# Altium project EPS.PrjPcb (part 2 of 4)

## Sheet EPS_MPPT_XY_Interface.SchDoc: MPPT-X and MPPT-Y / Interface
size A4; Date: 2015-10-14; ApprovedBy: (not approved); CheckedBy: (not checked); Author: Piotr Kuligowski; DocumentNumber: PWSat2-xxx-DW-xxx; Revision: 3; SheetNumber: 10; SheetTotal: 51; Model: FPM
Used 3 times, as channels Top/MPPT X/MPPTX Interface to uC, Top/MPPT Y+/MPPTY Interface to uC, Top/MPPT Y-/MPPTY Interface to uC. Parts and nets are listed once, with the designators drawn on the sheet.
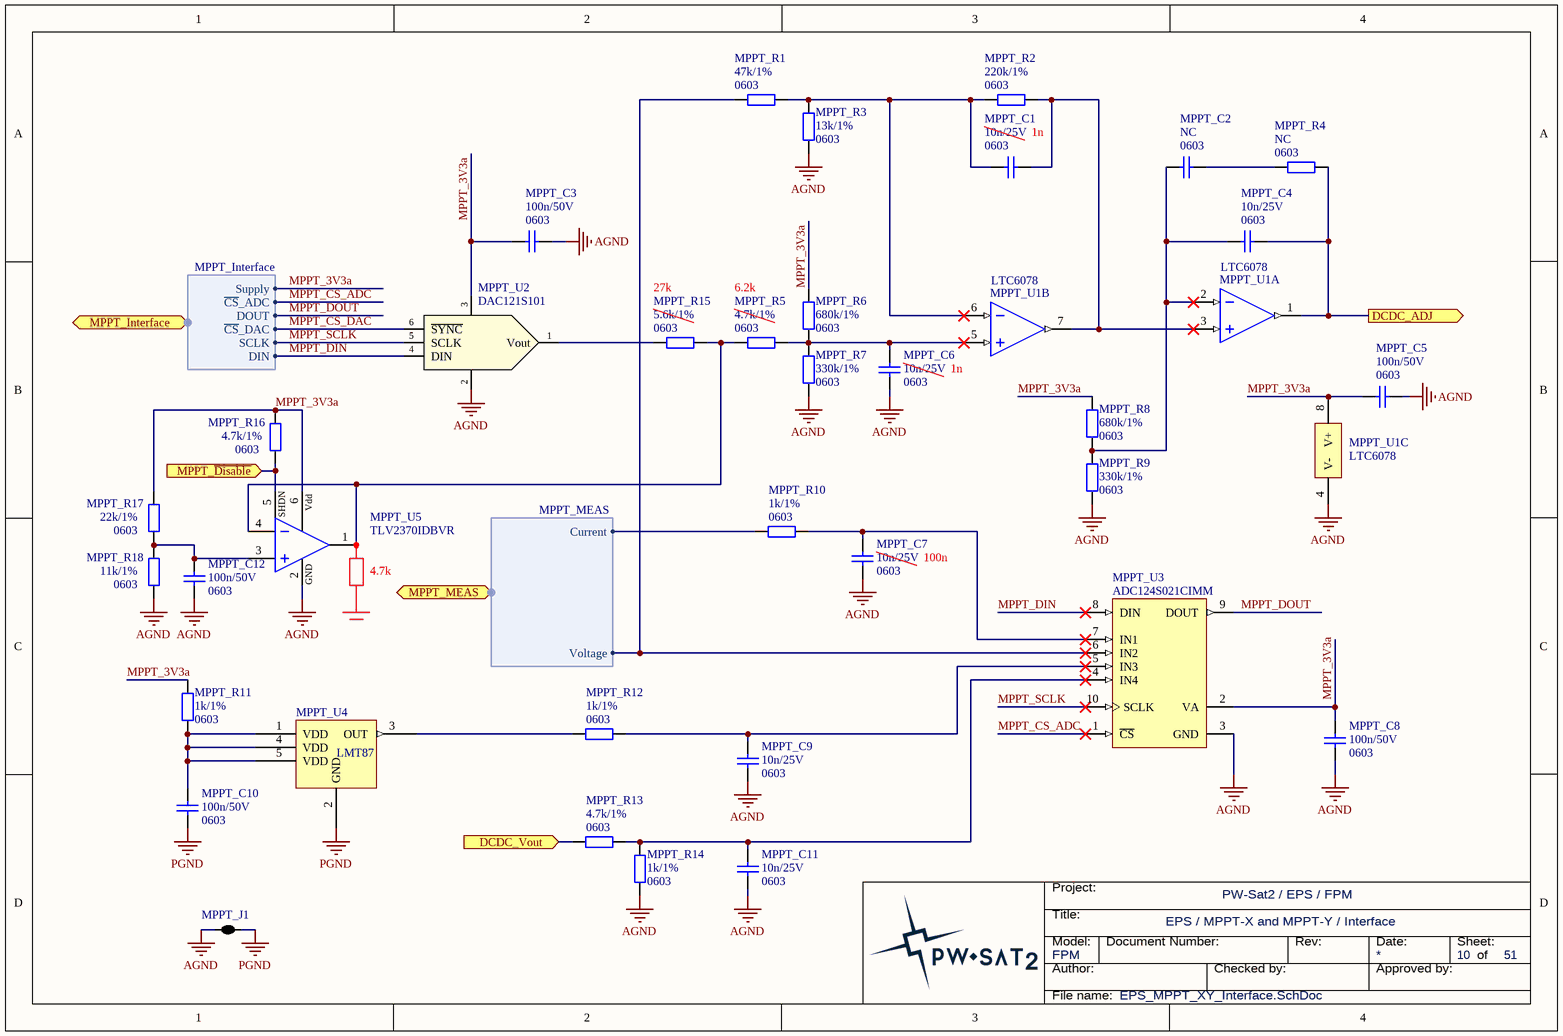
[diagram p8: EPS_MPPT_XY_Interface.SchDoc]

### Parts
MPPT_C1  value 10n/25V  Package: 0603  [SMD_Capacitor_0603]  (hidden comment: Cap)
MPPT_C2  value NC  Package: 0603  [SMD_Capacitor_0603]  (hidden comment: Cap)
MPPT_C3  Package: 0603  [SMD_Capacitor_0603]  (hidden comment: 100n/50V)
MPPT_C4  value 10n/25V  Package: 0603  [SMD_Capacitor_0603]  (hidden comment: Cap)
MPPT_C5  Package: 0603  [SMD_Capacitor_0603]  (hidden comment: 100n/50V)
MPPT_C6  value 10n/25V  Package: 0603  [SMD_Capacitor_0603]  (hidden comment: Cap)
MPPT_C7  value 10n/25V  Package: 0603  [SMD_Capacitor_0603]  (hidden comment: Cap)
MPPT_C8  Package: 0603  [SMD_Capacitor_0603]  (hidden comment: 100n/50V)
MPPT_C9  value 10n/25V  Package: 0603  [SMD_Capacitor_0603]  (hidden comment: Cap)
MPPT_C10  Package: 0603  [SMD_Capacitor_0603]  (hidden comment: 100n/50V)
MPPT_C11  value 10n/25V  Package: 0603  [SMD_Capacitor_0603]  (hidden comment: Cap)
MPPT_C12  value 100n/50V  Package: 0603  [SMD_Capacitor_0603]  (hidden comment: Cap)
MPPT_J1  2 way net tie junction  [2way_LP]  (value not drawn)  (net tie, no BOM)
MPPT_R1  Package: 0603  [SMD_Resistor_0603]  (hidden comment: 47k/1%)
MPPT_R2  Package: 0603  [SMD_Resistor_0603]  (hidden comment: 220k/1%)
MPPT_R3  Package: 0603  [SMD_Resistor_0603]  (hidden comment: 13k/1%)
MPPT_R4  Package: 0603  [SMD_Resistor_0603]  (hidden comment: NC)
MPPT_R5  Package: 0603  [SMD_Resistor_0603]  (hidden comment: 4.7k/1%)
MPPT_R6  Package: 0603  [SMD_Resistor_0603]  (hidden comment: 680k/1%)
MPPT_R7  Package: 0603  [SMD_Resistor_0603]  (hidden comment: 330k/1%)
MPPT_R8  Package: 0603  [SMD_Resistor_0603]  (hidden comment: 680k/1%)
MPPT_R9  Package: 0603  [SMD_Resistor_0603]  (hidden comment: 330k/1%)
MPPT_R10  Package: 0603  [SMD_Resistor_0603]  (hidden comment: 1k/1%)
MPPT_R11  Package: 0603  [SMD_Resistor_0603]  (hidden comment: 1k/1%)
MPPT_R12  Package: 0603  [SMD_Resistor_0603]  (hidden comment: 1k/1%)
MPPT_R13  Package: 0603  [SMD_Resistor_0603]  (hidden comment: 4.7k/1%)
MPPT_R14  Package: 0603  [SMD_Resistor_0603]  (hidden comment: 1k/1%)
MPPT_R15  Package: 0603  [SMD_Resistor_0603]  (hidden comment: 5.6k/1%)
MPPT_R16  Package: 0603  [SMD_Resistor_0603]  (hidden comment: 4.7k/1%)
MPPT_R17  Package: 0603  [SMD_Resistor_0603]  (hidden comment: 22k/1%)
MPPT_R18  Package: 0603  [SMD_Resistor_0603]  (hidden comment: 11k/1%)
MPPT_U1  LTC6078  [MSOP-8]  (parts A,B,C of 3)
MPPT_U2  DAC121S101  [SOT23-6]
MPPT_U3  ADC124S021CIMM  [MUB10A_L]
MPPT_U4  LMT87  [SC70-LT5_N]
MPPT_U5  (no value)  [SOT23-6]

### Ports
DCDC_ADJ (out), DCDC_Vout (in), MPPT_Interface (harness MPPT_Interface), MPPT_MEAS (harness MPPT_MEAS), MPPT_~{Disable} (in)

### Harnesses
MPPT_Interface: DIN, DOUT, SCLK, ~{CS}_DAC, ~{CS}_ADC, Supply
MPPT_MEAS: Voltage, Current

### Nets
AGND: MPPT_C3.1 MPPT_C5.2 MPPT_C6.1 MPPT_C7.1 MPPT_C8.2 MPPT_C9.1 MPPT_C11.1 MPPT_C12.1 MPPT_J1.2 MPPT_R3.1 MPPT_R7.1 MPPT_R9.1 MPPT_R14.1 MPPT_R18.2 MPPT_U1.4(V-) MPPT_U2.2(GND) MPPT_U3.3(GND) MPPT_U5.2(GND)
PGND: MPPT_C10.2 MPPT_J1.1 MPPT_U4.2(GND)
DCDC_ADJ: MPPT_C4.2 MPPT_R4.1 MPPT_U1.1(OUT_A) ; port DCDC_ADJ
DCDC_Vout: MPPT_R13.2 ; port DCDC_Vout
MPPT_3V3a: MPPT_C3.2 MPPT_C5.1 MPPT_C8.1 MPPT_R6.2 MPPT_R8.2 MPPT_R11.1 MPPT_R16.1 MPPT_R17.1 MPPT_U1.8(V+) MPPT_U2.3(Va) MPPT_U3.2(VA) MPPT_U5.6(Vdd) ; port MPPT_Interface.Supply
MPPT_CS_ADC: MPPT_U3.1(~{CS}) ; port MPPT_Interface.~{CS}_ADC
MPPT_CS_DAC: MPPT_U2.6(~{SYNC}) ; port MPPT_Interface.~{CS}_DAC
MPPT_~{Disable}: MPPT_R16.2 MPPT_U5.5(SHDN) ; port MPPT_~{Disable}
MPPT_DIN: MPPT_U2.4(DIN) MPPT_U3.8(DIN) ; port MPPT_Interface.DIN
MPPT_DOUT: MPPT_U3.9(DOUT) ; port MPPT_Interface.DOUT
MPPT_SCLK: MPPT_U2.5(SCLK) MPPT_U3.10(SCLK) ; port MPPT_Interface.SCLK
NetMPPT_C1_1: MPPT_C1.1 MPPT_R1.1 MPPT_R2.2 MPPT_R3.2 MPPT_U1.6(IN-_B)
NetMPPT_C1_2: MPPT_C1.2 MPPT_R2.1 MPPT_U1.3(IN+_A) MPPT_U1.7(OUT_B)
NetMPPT_C2_1: MPPT_C2.1 MPPT_C4.1 MPPT_R8.1 MPPT_R9.2 MPPT_U1.2(IN-_A)
NetMPPT_C2_2: MPPT_C2.2 MPPT_R4.2
NetMPPT_C6_2: MPPT_C6.2 MPPT_R5.1 MPPT_R6.1 MPPT_R7.2 MPPT_U1.5(IN+_B)
NetMPPT_C7_2: MPPT_C7.2 MPPT_R10.1 MPPT_U3.7(IN1)
NetMPPT_C9_2: MPPT_C9.2 MPPT_R12.1 MPPT_U3.5(IN3)
NetMPPT_C10_1: MPPT_C10.1 MPPT_R11.2 MPPT_U4.1(VDD) MPPT_U4.4(VDD) MPPT_U4.5(VDD)
NetMPPT_C11_2: MPPT_C11.2 MPPT_R13.1 MPPT_R14.2 MPPT_U3.4(IN4)
NetMPPT_C12_2: MPPT_C12.2 MPPT_R17.2 MPPT_R18.1 MPPT_U5.3(IN+)
NetMPPT_R1_2: MPPT_R1.2 MPPT_U3.6(IN2) ; port MPPT_MEAS.Voltage
NetMPPT_R5_2: MPPT_R5.2 MPPT_R15.1 MPPT_U5.1(OUT) MPPT_U5.4(IN-)
NetMPPT_R10_2: MPPT_R10.2 ; port MPPT_MEAS.Current
NetMPPT_R12_2: MPPT_R12.2 MPPT_U4.3(OUT)
NetMPPT_R15_2: MPPT_R15.2 MPPT_U2.1(Vout)

### Channels
Top/MPPT X/MPPTX Interface to uC: designators end in _1; ports DCDC_ADJ=NetDCDCX_R7_2 DCDC_Vout=NetMPPT_R13_1_2 MPPT_~{Disable}=NetCTRLB_U1_1
Top/MPPT Y+/MPPTY Interface to uC: designators end in _2; ports DCDC_ADJ=NetDCDCY_R7_1_1 DCDC_Vout=NetEMIYO_C1_1_1 MPPT_~{Disable}=NetCTRLB_U1_2
Top/MPPT Y-/MPPTY Interface to uC: designators end in _3; ports DCDC_ADJ=NetDCDCY_R7_2_1 DCDC_Vout=NetEMIYO_C1_2_1 MPPT_~{Disable}=NetCTRLB_U1_3

### Notes on the sheet
- 1n
- (near MPPT_R15) 27k
- 6.2k
- (near MPPT_U1) 1n
- (near MPPT_U5) 4.7k
- 100n
- Title:
- Project:
- Author:
- Model:
- Document Number:
- Checked by:
- Rev:
- Date:
- Approved by:
- Sheet:
- of
- File name:

### Library data of the parts
MPPT_C3 MPPT_C5 MPPT_C8 MPPT_C10 = Cer_C0603T104K5RALTU: Ceramic Cap Kemet COTS 100n/50V X7R 0603; Manufacturer: Kemet; ManufacturerPartNumber: C0603T104K5RALTU; Value: 100n/50V
MPPT_J1 = 2way: ComponentLink1URL: http://www.edatools.cz/addons; ComponentLink1Description: Source; FootprintNote: LP=12mil, MP=40mil, HP=120mil
MPPT_R1-MPPT_R15 = Res
  MPPT_R1: Value: 47k/1%
  MPPT_R2: Value: 220k/1%
  MPPT_R3: Value: 13k/1%
  MPPT_R4: Value: NC
  MPPT_R5 MPPT_R13: Value: 4.7k/1%
  MPPT_R6 MPPT_R8: Value: 680k/1%
  MPPT_R7 MPPT_R9: Value: 330k/1%
  MPPT_R10-MPPT_R12 MPPT_R14: Value: 1k/1%
  MPPT_R15: Value: 5.6k/1%
MPPT_R16-MPPT_R18 = CRCW06034K70FKxxxx: 4.7k/1% Vishay CRCW 0603 Resistor. 100mW, 100ppm, 75V.; Manufacturer: Vishay; ManufactuerPartNumber: CRCW06034K70FKxxxx
  MPPT_R16: Value: 4.7k/1%
  MPPT_R17: Value: 22k/1%
  MPPT_R18: Value: 11k/1%
MPPT_U1 = LTC6078: Rail-to-rail, quad operational amplifier. Library compatible with LTC608X LTC607X op-amps; Manufacturer: Linear Technology; Value: LTC6078
MPPT_U2 = DAC121S101: 12-Bit Micro Power, RRO Digital-to-Analog Converter.; Manufacturer: Texas Instruments; Value: DAC121S101
MPPT_U3 = ADC124S021CIMM/NOPB: Manufacturer: Texas Instruments; ManufacturerPartNumber: ADC124S021CIMM/NOPB; Value: ADC124S021CIMM
MPPT_U4 = LMT87: Analog Temperature Sensors with Class-AB Output
MPPT_U5 = TLV2370IDBVR: 3-MHz Rail-to-Rail In/Out Single Operational Amplifier; Manufacturer: Texas Instruments; HelpUrl: http://www.ti.com/lit/ds/symlink/tlv2370.pdf; ManufacturerPartNumber: TLV2370IDBVR

## Sheet EPS_MPPT_XY_Measurements.SchDoc: MPPT-X and MPPT-Y / Measurements
size A4; ApprovedBy: (not approved); CheckedBy: (not checked); Author: Piotr Kuligowski; DocumentNumber: PWSat2-xxx-DW-xxx; Revision: 3; SheetNumber: 7; SheetTotal: 51; Model: FPM
Used 3 times, as channels Top/MPPT X/MPPTX Measurements, Top/MPPT Y+/MPPTY Measurements, Top/MPPT Y-/MPPTY Measurements. Parts and nets are listed once, with the designators drawn on the sheet.
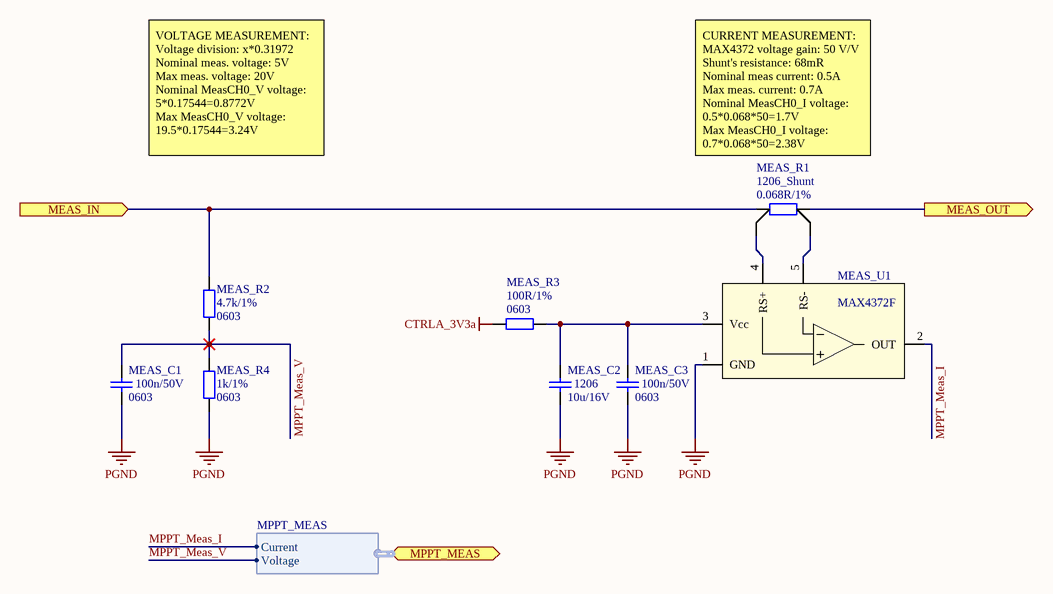
[diagram p9: EPS_MPPT_XY_Measurements.SchDoc]

### Parts
MEAS_C1  Package: 0603  [SMD_Capacitor_0603]  (hidden comment: 100n/50V)
MEAS_C2  Packge: 1206  [SMD_Capacitor_1206]  (hidden comment: 10u/16V)
MEAS_C3  Package: 0603  [SMD_Capacitor_0603]  (hidden comment: 100n/50V)
MEAS_R1  Package: 1206_Shunt  [SMD_Resistor-Shunt_1206]  (hidden comment: 0.068R/1%)
MEAS_R2  Package: 0603  [SMD_Resistor_0603]  (hidden comment: 4.7k/1%)
MEAS_R3  Package: 0603  [SMD_Resistor_0603]  (hidden comment: 100R/1%)
MEAS_R4  Package: 0603  [SMD_Resistor_0603]  (hidden comment: 1k/1%)
MEAS_U1  MAX4372F  [SOT23-5]

### Ports
MEAS_IN (in), MEAS_OUT (out), MPPT_MEAS (harness MPPT_MEAS)

### Harnesses
MPPT_MEAS: Voltage, Current

### Nets
CTRLA_3V3a: MEAS_R3.1
PGND: MEAS_C1.2 MEAS_C2.2 MEAS_C3.2 MEAS_R4.2 MEAS_U1.1(GND)
MEAS_IN: MEAS_R1.1 MEAS_R2.1 ; port MEAS_IN
MEAS_OUT: MEAS_R1.4 ; port MEAS_OUT
MPPT_Meas_I: MEAS_U1.2(OUT) ; port MPPT_MEAS.Current
MPPT_Meas_V: MEAS_C1.1 MEAS_R2.2 MEAS_R4.1 ; port MPPT_MEAS.Voltage
NetMEAS_C2_1: MEAS_C2.1 MEAS_C3.1 MEAS_R3.2 MEAS_U1.3(Vcc)
NetMEAS_R1_2: MEAS_R1.2 MEAS_U1.4(RS+)
NetMEAS_R1_3: MEAS_R1.3 MEAS_U1.5(RS-)

### Channels
Top/MPPT X/MPPTX Measurements: designators end in _1; ports MEAS_IN=NetMEAS_R1_1_1 MEAS_OUT=NetEMIXI_C1_1
Top/MPPT Y+/MPPTY Measurements: designators end in _2; ports MEAS_IN=NetMEAS_R1_2_1 MEAS_OUT=NetEMIYI_C1_1_1
Top/MPPT Y-/MPPTY Measurements: designators end in _3; ports MEAS_IN=NetMEAS_R1_3_1 MEAS_OUT=NetEMIYI_C1_2_1

### Notes on the sheet
- VOLTAGE MEASUREMENT:
  Voltage division: x*0.31972
  Nominal meas. voltage: 5V
  Max meas. voltage: 20V
  Nominal MeasCH0_V voltage: 5*0.17544=0.8772V
  Max MeasCH0_V voltage: 19.5*0.17544=3.24V
- CURRENT MEASUREMENT:
  MAX4372 voltage gain: 50 V/V
  Shunt's resistance: 68mR
  Nominal meas current: 0.5A
  Max meas. current: 0.7A
  Nominal MeasCH0_I voltage: 0.5*0.068*50=1.7V
  Max MeasCH0_I voltage: 0.7*0.068*50=2.38V
- Title:
- Project:
- Author:
- Model:
- Document Number:
- Checked by:
- Rev:
- Date:
- Approved by:
- Sheet:
- of
- File name:

### Library data of the parts
MEAS_C1 MEAS_C3 = Cer_C0603T104K5RALTU: Ceramic Cap Kemet COTS 100n/50V X7R 0603; Manufacturer: Kemet; ManufacturerPartNumber: C0603T104K5RALTU; Value: 100n/50V
MEAS_C2 = Cer_C1206T106K4RACTU: Ceramic Cap Kemet COTS 10u/16V X7R 1206; ManufacturerPartNumber: C1206T106K4RACTU; Manufacturer: Kemet; Value: 10u/16V
MEAS_R1 = ERJ-8BWFR068V: Panasonic Resistor 68mR 1% 1206 1W; Manufacturer: Panasonic; ManufacturerPartNumber: ERJ-8BWFR068V; Value: 0.068R/1%
MEAS_R2-MEAS_R4 = Res
  MEAS_R2: Value: 4.7k/1%
  MEAS_R3: Value: 100R/1%
  MEAS_R4: Value: 1k/1%
MEAS_U1 = MAX4372: High-Side Current-Sense Amplifier with Voltage Output; Manufacturer: Maxim Integrated Products; Value: MAX4372F

## Sheet EPS_MPPT_X_EMI-Filter_In.SchDoc: MPPT-X / EMI-Filter / In
size A4; ApprovedBy: (not approved); CheckedBy: (not checked); Author: Piotr Kuligowski; DocumentNumber: PWSat2-xxx-DW-xxx; Revision: 3; SheetNumber: 8; SheetTotal: 51; Model: FPM
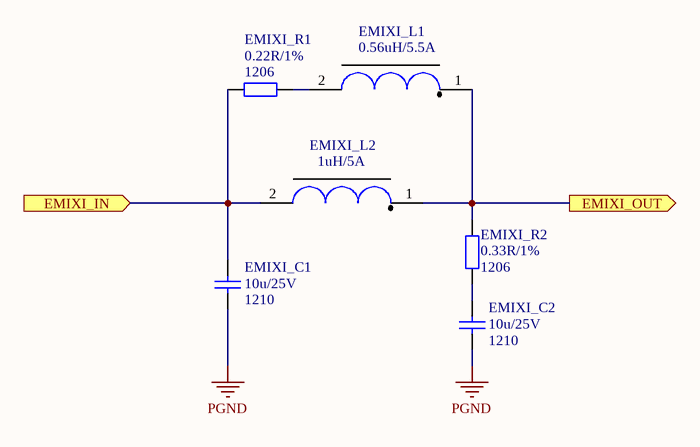
[diagram p10: EPS_MPPT_X_EMI-Filter_In.SchDoc]

### Parts
EMIXI_C1  Package: 1210  [SMD_Capacitor_1210]  (hidden comment: 10u/25V)
EMIXI_C2  Package: 1210  [SMD_Capacitor_1210]  (hidden comment: 10u/25V)
EMIXI_L1  0.56uH/5.5A  [Vishay_IHLP1212]
EMIXI_L2  1uH/5A  [Vishay_IHLP1212]
EMIXI_R1  Package: 1206  [SMD_Resistor_1206]  (hidden comment: 0.22R/1%)
EMIXI_R2  Package: 1206  [SMD_Resistor_1206]  (hidden comment: 0.33R/1%)

### Ports
EMIXI_IN (in), EMIXI_OUT (out)

### Nets
PGND: EMIXI_C1.2 EMIXI_C2.2
NetDCDCX_C1_2: EMIXI_L1.1 EMIXI_L2.1 EMIXI_R2.2 ; port EMIXI_OUT
NetEMIXI_C1_1: EMIXI_C1.1 EMIXI_L2.2 EMIXI_R1.1 ; port EMIXI_IN
NetEMIXI_C2_1: EMIXI_C2.1 EMIXI_R2.1
NetEMIXI_L1_2: EMIXI_L1.2 EMIXI_R1.2

### Notes on the sheet
- Title:
- Project:
- Author:
- Model:
- Document Number:
- Checked by:
- Rev:
- Date:
- Approved by:
- Sheet:
- of
- File name:

### Library data of the parts
EMIXI_C1 EMIXI_C2 = Cer_GCJ32ER71E106KA12L: Ceramic Cap Murata Automotive 10u/25V X7R 1210; Manufacturer: Murata; ManufacturerPartNumber: GCJ32ER71E106KA12L; Value: 10u/25V
EMIXI_L1 = IHLP1212BZERR56M11: Vishay IHLP1212 Inductor, L=0.56uH, Irise40deg=5.5A, ESR=16mR, SRF=1MHz.; Manufacturer: Vishay; ManufacturerPartNumber: IHLP1212BZERR56M11; Value: 0.56uH/5.5A
EMIXI_L2 = IHLP1212BZER1R0M11: Vishay IHLP1212 Inductor, L=1uH, Irise40deg=5A, ESR=20mR, SRF=1MHz.; Manufacturer: Vishay; ManufacturerPartNumber: IHLP1212BZER1R0M11; Value: 1uH/5A
EMIXI_R1 = ERJ-8BQFR22V: Panasonic Resistor 0.22R 1% 1206 330mW; Manufacturer: Panasonic; ManufacturerPartNumber: ERJ-8BQFR22V; Value: 0.22R/1%
EMIXI_R2 = ERJ-8BQFR33V: Panasonic Resistor 0.33R 1% 1206 330mW; Manufacturer: Panasonic; ManufacturerPartNumber: ERJ-8BQFR33V; Value: 0.33R/1%

## Sheet EPS_MPPT_X_OR_MPB.SchDoc: MPPT-X / MPB ORing
size A4; ApprovedBy: (not approved); CheckedBy: (not checked); Author: Piotr Kuligowski; DocumentNumber: PWSat2-xxx-DW-xxx; Revision: 3; SheetNumber: 12; SheetTotal: 51; Model: FPM
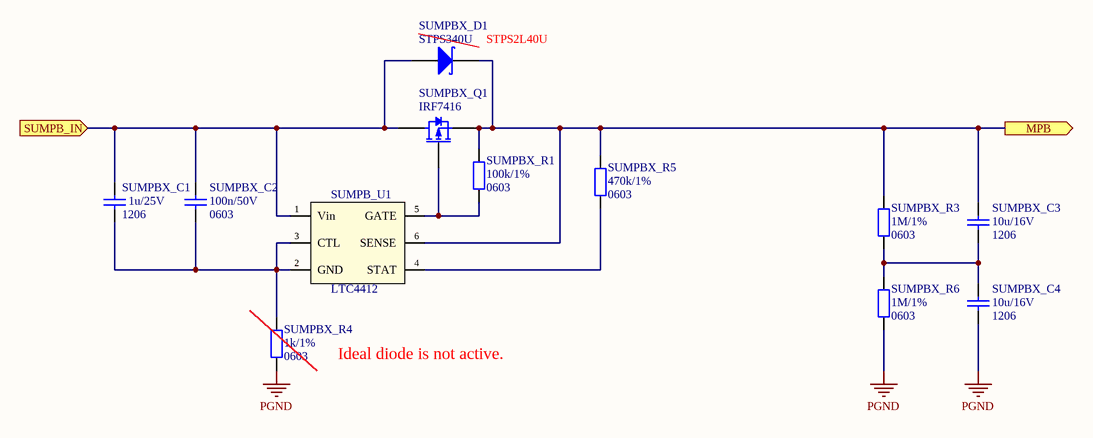
[diagram p11: EPS_MPPT_X_OR_MPB.SchDoc]

### Parts
SUMPB_U1  LTC4412  [SOT23-6]
SUMPBX_C1  Package: 1206  [SMD_Capacitor_1206]  (hidden comment: 1u/25V)
SUMPBX_C2  Package: 0603  [SMD_Capacitor_0603]  (hidden comment: 100n/50V)
SUMPBX_C3  Packge: 1206  [SMD_Capacitor_1206]  (hidden comment: 10u/16V)
SUMPBX_C4  Packge: 1206  [SMD_Capacitor_1206]  (hidden comment: 10u/16V)
SUMPBX_D1  STPS340U  [DO-214AA]
SUMPBX_Q1  IRF7416  [SOIC-8-N_SSSGDDDD]
SUMPBX_R1  Package: 0603  [SMD_Resistor_0603]  (hidden comment: 100k/1%)
SUMPBX_R3  Package: 0603  [SMD_Resistor_0603]  (hidden comment: 1M/1%)
SUMPBX_R4  Package: 0603  [SMD_Resistor_0603]  (hidden comment: 1k/1%)
SUMPBX_R5  Package: 0603  [SMD_Resistor_0603]  (hidden comment: 470k/1%)
SUMPBX_R6  Package: 0603  [SMD_Resistor_0603]  (hidden comment: 1M/1%)

### Ports
MPB (out), SUMPB_IN (in)

### Nets
PGND: SUMPBX_C4.2 SUMPBX_R4.2 SUMPBX_R6.2
PC-104_Kill-Switch_Pri: SUMPB_U1.6(SENSE) SUMPBX_C3.1 SUMPBX_D1.K SUMPBX_Q1.S SUMPBX_R1.1 SUMPBX_R3.1 SUMPBX_R5.1 ; port MPB
NetMPPT_R13_1_2: SUMPB_U1.1(Vin) SUMPBX_C1.1 SUMPBX_C2.1 SUMPBX_D1.A SUMPBX_Q1.D ; port SUMPB_IN
NetSUMPB_U1_2: SUMPB_U1.2(GND) SUMPB_U1.3(CTL) SUMPBX_C1.2 SUMPBX_C2.2 SUMPBX_R4.1
NetSUMPB_U1_4: SUMPB_U1.4(STAT) SUMPBX_R5.2
NetSUMPB_U1_5: SUMPB_U1.5(GATE) SUMPBX_Q1.G SUMPBX_R1.2
NetSUMPBX_C3_2: SUMPBX_C3.2 SUMPBX_C4.1 SUMPBX_R3.2 SUMPBX_R6.1

### Notes on the sheet
- (near SUMPBX_D1) STPS2L40U
- Ideal diode is not active.
- Title:
- Project:
- Author:
- Model:
- Document Number:
- Checked by:
- Rev:
- Date:
- Approved by:
- Sheet:
- of
- File name:

### Library data of the parts
SUMPB_U1 = LTC4412: Ideal Diode, Low Loss PowerPath Controller.; Manufacturer: Linear Technology; Value: LTC4412
SUMPBX_C1 = Cer_C1206T105K3RALTU: Ceramic Cap Kemet COTS 1u/25V X7R 1206; ManufacturerPartNumber: C1206T105K3RALTU; Manufacturer: Kemet; Value: 1u/25V
SUMPBX_C2 = Cer_GCJ188R71H104KA12D: Ceramic Cap Murata Automotive 100n/50V X7R 0603; Manufacturer: Murata; ManufacturerPartNumber: GCJ188R71H104KA12D; Value: 100n/50V
SUMPBX_C3 SUMPBX_C4 = Cer_C1206T106K4RACTU: Ceramic Cap Kemet COTS 10u/16V X7R 1206; ManufacturerPartNumber: C1206T106K4RACTU; Manufacturer: Kemet; Value: 10u/16V
SUMPBX_D1 = STPS340x: 3A/40V Power Schottky Rectifier.; Manufacturer: STMicroelectronics; Value: STPS340U
SUMPBX_Q1 = IRF7416: 10A/30V HEXFET Power P-MOSFET.; Manufacturer: International Rectifier; Value: IRF7416
SUMPBX_R1 SUMPBX_R3-SUMPBX_R6 = Res
  SUMPBX_R1: Value: 100k/1%
  SUMPBX_R3 SUMPBX_R6: Value: 1M/1%
  SUMPBX_R4: Value: 1k/1%
  SUMPBX_R5: Value: 470k/1%

## Sheet EPS_MPPT_Y.SchDoc: MPPT-Y
size A3; ApprovedBy: (not approved); CheckedBy: (not checked); Author: Piotr Kuligowski; DocumentNumber: PWSat2-xxx-DW-xxx; Revision: 3; SheetNumber: 17; SheetTotal: 51; Model: FPM
Used 2 times, as channels Top/MPPT Y+, Top/MPPT Y-. Parts and nets are listed once, with the designators drawn on the sheet.
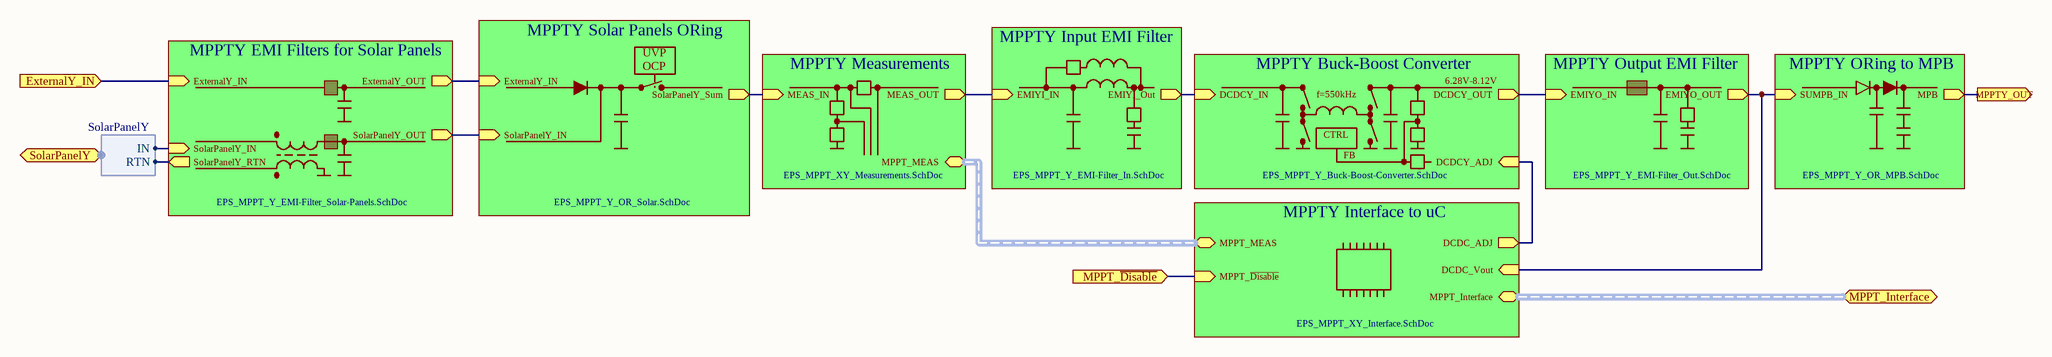
[diagram p12: EPS_MPPT_Y.SchDoc]

### Sub-sheets
MPPTY Buck-Boost Converter = EPS_MPPT_Y_Buck-Boost-Converter.SchDoc: DCDCY_IN (in), DCDCY_OUT (out), DCDCY_ADJ (in)
MPPTY EMI Filters for Solar Panels = EPS_MPPT_Y_EMI-Filter_Solar-Panels.SchDoc: SolarPanelY_IN (in), ExternalY_IN (in), SolarPanelY_RTN (out), ExternalY_OUT (out), SolarPanelY_OUT (out)
MPPTY Input EMI Filter = EPS_MPPT_Y_EMI-Filter_In.SchDoc: EMIYI_Out (out), EMIYI_IN (in)
MPPTY Interface to uC = EPS_MPPT_XY_Interface.SchDoc: DCDC_ADJ (out), MPPT_Interface (harness MPPT_Interface), MPPT_MEAS (harness MPPT_MEAS), DCDC_Vout (in), MPPT_~{Disable} (in)
MPPTY Measurements = EPS_MPPT_XY_Measurements.SchDoc: MEAS_IN (in), MEAS_OUT (out), MPPT_MEAS (harness MPPT_MEAS)
MPPTY ORing to MPB = EPS_MPPT_Y_OR_MPB.SchDoc: SUMPB_IN (in), MPB (out)
MPPTY Output EMI Filter = EPS_MPPT_Y_EMI-Filter_Out.SchDoc: EMIYO_IN (in), EMIYO_OUT (out)
MPPTY Solar Panels ORing = EPS_MPPT_Y_OR_Solar.SchDoc (file not in this document): ExternalY_IN (in), SolarPanelY_IN (in), SolarPanelY_Sum (out)

### Ports
ExternalY_IN (in), MPPT_Interface (harness MPPT_Interface), MPPT_~{Disable} (in), MPPTY_OUT (out), SolarPanelY (harness SolarPanelY)

### Harnesses
SolarPanelY: IN, RTN

### Nets
ExternalY_IN: port ExternalY_IN, sheet MPPTY EMI Filters for Solar Panels/ExternalY_IN
MPPT_~{Disable}: port MPPT_~{Disable}, sheet MPPTY Interface to uC/MPPT_~{Disable}
MPPTY_OUT: port MPPTY_OUT, sheet MPPTY ORing to MPB/MPB
(unnamed): sheet MPPTY Buck-Boost Converter/DCDCY_IN, sheet MPPTY Input EMI Filter/EMIYI_Out
(unnamed): sheet MPPTY Buck-Boost Converter/DCDCY_OUT, sheet MPPTY Output EMI Filter/EMIYO_IN
(unnamed): sheet MPPTY Buck-Boost Converter/DCDCY_ADJ, sheet MPPTY Interface to uC/DCDC_ADJ
(unnamed): sheet MPPTY Solar Panels ORing/ExternalY_IN, sheet MPPTY EMI Filters for Solar Panels/ExternalY_OUT
(unnamed): sheet MPPTY Solar Panels ORing/SolarPanelY_IN, sheet MPPTY EMI Filters for Solar Panels/SolarPanelY_OUT
(unnamed): sheet MPPTY Solar Panels ORing/SolarPanelY_Sum, sheet MPPTY Measurements/MEAS_IN
(unnamed): sheet MPPTY EMI Filters for Solar Panels/SolarPanelY_IN, port SolarPanelY.IN
(unnamed): sheet MPPTY EMI Filters for Solar Panels/SolarPanelY_RTN, port SolarPanelY.RTN
(unnamed): sheet MPPTY Interface to uC/DCDC_Vout, sheet MPPTY Output EMI Filter/EMIYO_OUT, sheet MPPTY ORing to MPB/SUMPB_IN
(unnamed): sheet MPPTY Measurements/MEAS_OUT, sheet MPPTY Input EMI Filter/EMIYI_IN

### Channels
Top/MPPT Y+: ports ExternalY_IN=PC-104_EXTY+ MPPT_~{Disable}=NetCTRLB_U1_2 MPPTY_OUT=PC-104_Kill-Switch_Pri
Top/MPPT Y-: ports ExternalY_IN=PC-104_EXTY- MPPT_~{Disable}=NetCTRLB_U1_3 MPPTY_OUT=PC-104_Kill-Switch_Pri

### Buses and harness runs
harness port MPPT_Interface = sheet MPPTY Interface to uC/MPPT_Interface
harness sheet MPPTY Interface to uC/MPPT_MEAS = sheet MPPTY Measurements/MPPT_MEAS

### Notes on the sheet
- UVP
- OCP
- f=550kHz
- CTRL
- 6.28V-8.12V
- FB
- Title:
- Project:
- Author:
- Model:
- Document Number:
- Checked by:
- Rev:
- Date:
- Approved by:
- Sheet:
- of
- File name:

## Sheet EPS_MPPT_Y_Buck-Boost-Converter.SchDoc: Controlled Buck-Boost Converter CH1
size A4; Date: 2016-01-06; Author: Piotr Kuligowski; DocumentNumber: PWSat2-xxx-DW-xxx; Revision: 1-0; SheetNumber: 21; SheetTotal: 51; Model: EM1
Used 2 times, as channels Top/MPPT Y+/MPPTY Buck-Boost Converter, Top/MPPT Y-/MPPTY Buck-Boost Converter. Parts and nets are listed once, with the designators drawn on the sheet.
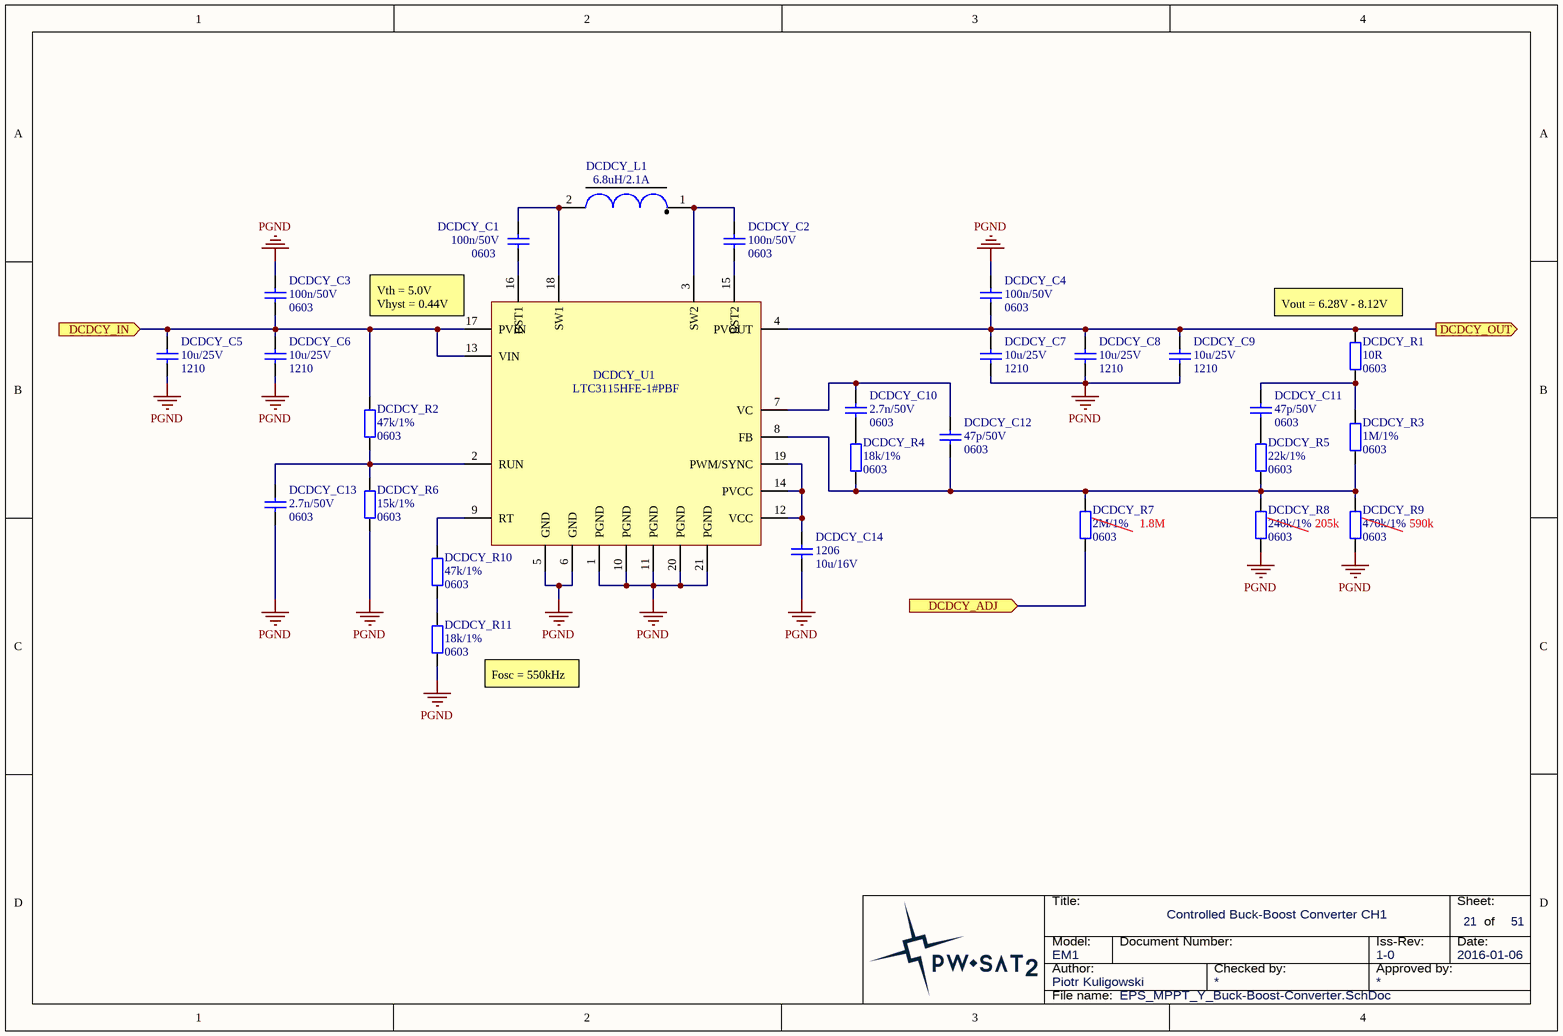
[diagram p13: EPS_MPPT_Y_Buck-Boost-Converter.SchDoc]

### Parts
DCDCY_C1  Package: 0603  [SMD_Capacitor_0603]  (hidden comment: 100n/50V)
DCDCY_C2  Package: 0603  [SMD_Capacitor_0603]  (hidden comment: 100n/50V)
DCDCY_C3  Package: 0603  [SMD_Capacitor_0603]  (hidden comment: 100n/50V)
DCDCY_C4  Package: 0603  [SMD_Capacitor_0603]  (hidden comment: 100n/50V)
DCDCY_C5  Package: 1210  [SMD_Capacitor_1210]  (hidden comment: 10u/25V)
DCDCY_C6  Package: 1210  [SMD_Capacitor_1210]  (hidden comment: 10u/25V)
DCDCY_C7  Package: 1210  [SMD_Capacitor_1210]  (hidden comment: 10u/25V)
DCDCY_C8  Package: 1210  [SMD_Capacitor_1210]  (hidden comment: 10u/25V)
DCDCY_C9  Package: 1210  [SMD_Capacitor_1210]  (hidden comment: 10u/25V)
DCDCY_C10  value 2.7n/50V  Package: 0603  [SMD_Capacitor_0603]  (hidden comment: Cap)
DCDCY_C11  value 47p/50V  Package: 0603  [SMD_Capacitor_0603]  (hidden comment: Cap)
DCDCY_C12  value 47p/50V  Package: 0603  [SMD_Capacitor_0603]  (hidden comment: Cap)
DCDCY_C13  value 2.7n/50V  Package: 0603  [SMD_Capacitor_0603]  (hidden comment: Cap)
DCDCY_C14  Packge: 1206  [SMD_Capacitor_1206]  (hidden comment: 10u/16V)
DCDCY_L1  6.8uH/2.1A  [Coilcraft_MSS6132]
DCDCY_R1  Package: 0603  [SMD_Resistor_0603]  (hidden comment: 10R)
DCDCY_R2  Package: 0603  [SMD_Resistor_0603]  (hidden comment: 47k/1%)
DCDCY_R3  Package: 0603  [SMD_Resistor_0603]  (hidden comment: 1M/1%)
DCDCY_R4  Package: 0603  [SMD_Resistor_0603]  (hidden comment: 18k/1%)
DCDCY_R5  Package: 0603  [SMD_Resistor_0603]  (hidden comment: 22k/1%)
DCDCY_R6  Package: 0603  [SMD_Resistor_0603]  (hidden comment: 15k/1%)
DCDCY_R7  Package: 0603  [SMD_Resistor_0603]  (hidden comment: 2M/1%)
DCDCY_R8  Package: 0603  [SMD_Resistor_0603]  (hidden comment: 240k/1%)
DCDCY_R9  Package: 0603  [SMD_Resistor_0603]  (hidden comment: 470k/1%)
DCDCY_R10  Package: 0603  [SMD_Resistor_0603]  (hidden comment: 47k/1%)
DCDCY_R11  Package: 0603  [SMD_Resistor_0603]  (hidden comment: 18k/1%)
DCDCY_U1  LTC3115HFE-1#PBF  [LT-FE-20-EPV-CA_N]

### Ports
DCDCY_ADJ (in), DCDCY_IN (in), DCDCY_OUT (out)

### Nets
PGND: DCDCY_C3.1 DCDCY_C4.1 DCDCY_C5.2 DCDCY_C6.2 DCDCY_C7.2 DCDCY_C8.2 DCDCY_C9.2 DCDCY_C13.2 DCDCY_C14.2 DCDCY_R6.2 DCDCY_R8.2 DCDCY_R9.2 DCDCY_R11.2 DCDCY_U1.1(PGND) DCDCY_U1.5(GND) DCDCY_U1.6(GND) DCDCY_U1.10(PGND) DCDCY_U1.11(PGND) DCDCY_U1.20(PGND) DCDCY_U1.21(PGND)
DCDCY_ADJ: DCDCY_R7.1 ; port DCDCY_ADJ
DCDCY_IN: DCDCY_C3.2 DCDCY_C5.1 DCDCY_C6.1 DCDCY_R2.1 DCDCY_U1.13(VIN) DCDCY_U1.17(PVIN) ; port DCDCY_IN
DCDCY_OUT: DCDCY_C4.2 DCDCY_C7.1 DCDCY_C8.1 DCDCY_C9.1 DCDCY_R1.1 DCDCY_U1.4(PVOUT) ; port DCDCY_OUT
NetDCDCY_C1_1: DCDCY_C1.1 DCDCY_L1.2 DCDCY_U1.18(SW1)
NetDCDCY_C1_2: DCDCY_C1.2 DCDCY_U1.16(BST1)
NetDCDCY_C2_1: DCDCY_C2.1 DCDCY_L1.1 DCDCY_U1.3(SW2)
NetDCDCY_C2_2: DCDCY_C2.2 DCDCY_U1.15(BST2)
NetDCDCY_C10_1: DCDCY_C10.1 DCDCY_C12.1 DCDCY_U1.7(VC)
NetDCDCY_C10_2: DCDCY_C10.2 DCDCY_R4.1
NetDCDCY_C11_1: DCDCY_C11.1 DCDCY_R1.2 DCDCY_R3.1
NetDCDCY_C11_2: DCDCY_C11.2 DCDCY_R5.1
NetDCDCY_C12_2: DCDCY_C12.2 DCDCY_R3.2 DCDCY_R4.2 DCDCY_R5.2 DCDCY_R7.2 DCDCY_R8.1 DCDCY_R9.1 DCDCY_U1.8(FB)
NetDCDCY_C13_1: DCDCY_C13.1 DCDCY_R2.2 DCDCY_R6.1 DCDCY_U1.2(RUN)
NetDCDCY_C14_1: DCDCY_C14.1 DCDCY_U1.12(VCC) DCDCY_U1.14(PVCC) DCDCY_U1.19(PWM/SYNC)
NetDCDCY_R10_1: DCDCY_R10.1 DCDCY_U1.9(RT)
NetDCDCY_R10_2: DCDCY_R10.2 DCDCY_R11.1

### Channels
Top/MPPT Y+/MPPTY Buck-Boost Converter: designators end in _1; ports DCDCY_ADJ=NetDCDCY_R7_1_1 DCDCY_IN=NetDCDCY_C3_1_2 DCDCY_OUT=NetDCDCY_C4_1_2
Top/MPPT Y-/MPPTY Buck-Boost Converter: designators end in _2; ports DCDCY_ADJ=NetDCDCY_R7_2_1 DCDCY_IN=NetDCDCY_C3_2_2 DCDCY_OUT=NetDCDCY_C4_2_2

### Notes on the sheet
- (near DCDCY_U1) Vth = 5.0V
  Vhyst = 0.44V
- (near DCDCY_R1) Vout = 6.28V - 8.12V
- 1.8M
- (near DCDCY_R9) 205k
- 590k
- (near DCDCY_R11) Fosc = 550kHz
- Title:
- Sheet:
- of
- Author:
- Model:
- Document Number:
- Checked by:
- Iss-Rev:
- Approved by:
- Date:
- File name:

### Library data of the parts
DCDCY_C1-DCDCY_C4 = Cer_C0603T104K5RALTU: Ceramic Cap Kemet COTS 100n/50V X7R 0603; Manufacturer: Kemet; ManufacturerPartNumber: C0603T104K5RALTU; Value: 100n/50V
DCDCY_C5-DCDCY_C9 = Cer_GCJ32ER71E106KA12L: as EMIXI_C1 on sheet EPS_MPPT_X_EMI-Filter_In; Manufacturer: Murata; ManufacturerPartNumber: GCJ32ER71E106KA12L; Value: 10u/25V
DCDCY_C14 = Cer_C1206T106K4RACTU: Ceramic Cap Kemet COTS 10u/16V X7R 1206; ManufacturerPartNumber: C1206T106K4RACTU; Manufacturer: Kemet; Value: 10u/16V
DCDCY_L1 = MSS6132-682MLx: Coilcraft MSS6132 Inductor, L=6.8uH, Irise20deg=2.1A, ESR=52mR, SRF=47MHz.; Manufacturer: Coilcraft; ManufacturerPartNumber: MSS6132-682MLx; Value: 6.8uH/2.1A
DCDCY_R1-DCDCY_R6 DCDCY_R8-DCDCY_R11 = Res
  DCDCY_R1: Value: 10R
  DCDCY_R2 DCDCY_R10: Value: 47k/1%
  DCDCY_R3: Value: 1M/1%
  DCDCY_R4 DCDCY_R11: Value: 18k/1%
  DCDCY_R5: Value: 22k/1%
  DCDCY_R6: Value: 15k/1%
  DCDCY_R8: Value: 240k/1%
  DCDCY_R9: Value: 470k/1%
DCDCY_R7 = CRCW06032M00FKxxxx: 2M/1% Vishay CRCW 0603 Resistor. 100mW, 200ppm, 75V.; ManufacturerPartNumber: CRCW06032M00FKxxxx; Manufacturer: Vishay; Value: 2M/1%
DCDCY_U1 = LTC3115HFE-1#PBF: 40V, 2A Synchronous Buck-Boost DC/DC Converter, 20-pin SOP (FE-20-EPV-CA), -40 to 150 degC, Pb-Free; Manufacturer: Linear Technology; Package: FE-20-EPV-CA; Value: LTC3115HFE-1#PBF

## Sheet EPS_MPPT_Y_EMI-Filter_Solar-Panels.SchDoc: MPPTY EMI Filters for Solar Panels
size A4; Date: 2015-02-21; Author: Piotr Kuligowski; DocumentNumber: PWSat2-xxx-DW-xxx; Revision: 1-0; SheetNumber: 18; SheetTotal: 51; Model: EM1
Used 2 times, as channels Top/MPPT Y+/MPPTY EMI Filters for Solar Panels, Top/MPPT Y-/MPPTY EMI Filters for Solar Panels. Parts and nets are listed once, with the designators drawn on the sheet.
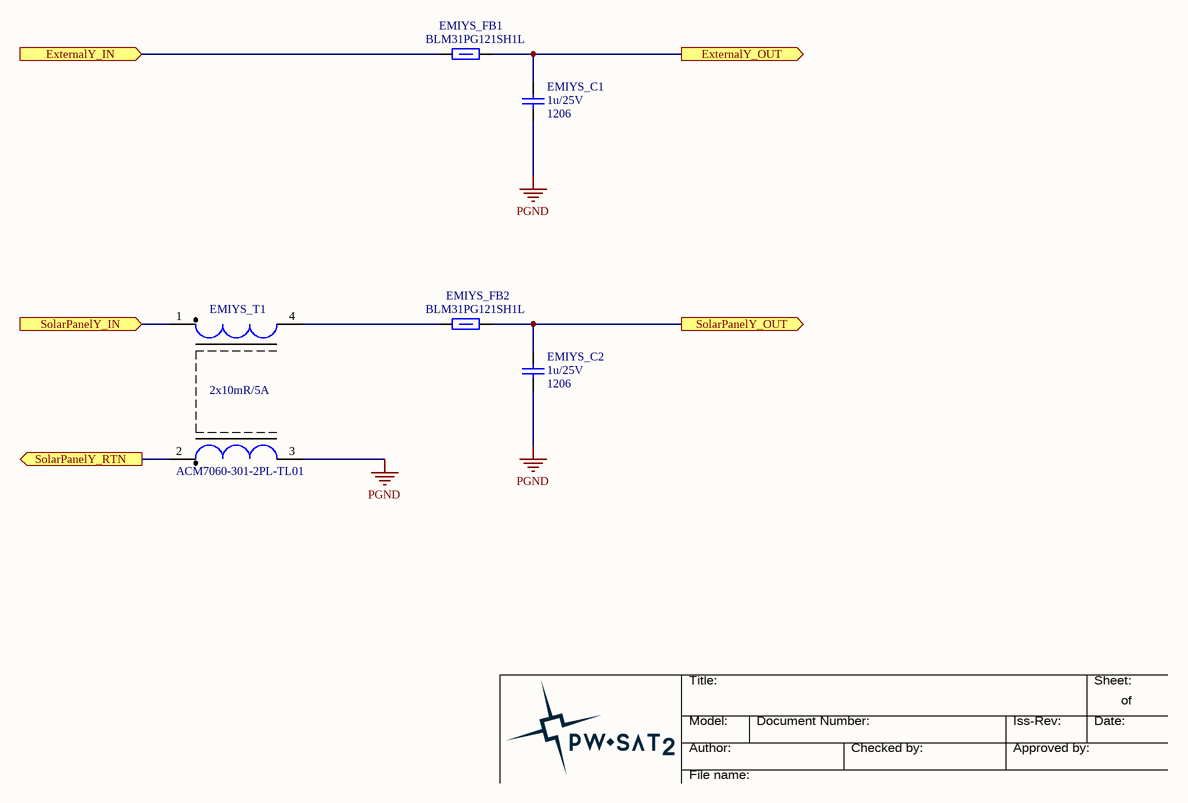
[diagram p14: EPS_MPPT_Y_EMI-Filter_Solar-Panels.SchDoc]

### Parts
EMIYS_C1  Package: 1206  [SMD_Capacitor_1206]  (hidden comment: 1u/25V)
EMIYS_C2  Package: 1206  [SMD_Capacitor_1206]  (hidden comment: 1u/25V)
EMIYS_FB1  120R/100MHz  [SMD_FerriteBead_1206]  (value not drawn)
EMIYS_FB2  120R/100MHz  [SMD_FerriteBead_1206]  (value not drawn)
EMIYS_T1  2x10mR/5A  [TDK_ACM7060]

### Ports
ExternalY_IN (in), ExternalY_OUT (out), SolarPanelY_IN (in), SolarPanelY_OUT (out), SolarPanelY_RTN (out)

### Nets
PGND: EMIYS_C1.2 EMIYS_C2.2 EMIYS_T1.3
ExternalY_IN: EMIYS_FB1.2 ; port ExternalY_IN
ExternalY_OUT: EMIYS_C1.1 EMIYS_FB1.1 ; port ExternalY_OUT
SolarPanelY_IN: EMIYS_T1.1 ; port SolarPanelY_IN
SolarPanelY_OUT: EMIYS_C2.1 EMIYS_FB2.1 ; port SolarPanelY_OUT
SolarPanelY_RTN: EMIYS_T1.2 ; port SolarPanelY_RTN
NetEMIYS_FB2_2: EMIYS_FB2.2 EMIYS_T1.4

### Channels
Top/MPPT Y+/MPPTY EMI Filters for Solar Panels: designators end in _1; ports ExternalY_IN=PC-104_EXTY+ ExternalY_OUT=NetEMIYS_C1_1_1 SolarPanelY_IN=NetEMIYS_T1_1_1 SolarPanelY_OUT=NetEMIYS_C2_1_1 SolarPanelY_RTN=NetEMIYS_T1_1_2
Top/MPPT Y-/MPPTY EMI Filters for Solar Panels: designators end in _2; ports ExternalY_IN=PC-104_EXTY- ExternalY_OUT=NetEMIYS_C1_2_1 SolarPanelY_IN=NetEMIYS_T1_2_1 SolarPanelY_OUT=NetEMIYS_C2_2_1 SolarPanelY_RTN=NetEMIYS_T1_2_2

### Notes on the sheet
- Title:
- Sheet:
- of
- Author:
- Model:
- Document Number:
- Checked by:
- Iss-Rev:
- Approved by:
- Date:
- File name:

### Library data of the parts
EMIYS_C1 EMIYS_C2 = Cer_C1206T105K3RALTU: Ceramic Cap Kemet COTS 1u/25V X7R 1206; ManufacturerPartNumber: C1206T105K3RALTU; Manufacturer: Kemet; Value: 1u/25V
EMIYS_FB1 EMIYS_FB2 = BLM31PG121SH1L: Ferrite bead, 1206, 0.02HM, 3.5A.; Manufacturer: Murata; Current Rating: 3.5A; Series Resistance DC: 0.02R; Package: 1206; Value: 120R/100MHz; ManufacturerPartNumber: BLM31PG121SH1L
EMIYS_T1 = ACM7060-301-2PL-TL01: TDK ACM7060-301 Common Mode Choke; Manufacturer: TDK; ManufacturerPartNumber: ACM7060-301-2PL-TL01; Value: 2x10mR/5A

## Sheet EPS_MPPT_Y_EMI-Filter_In.SchDoc: MPPTY Input EMI Filter
size A4; Date: 2015-10-11; Author: Piotr Kuligowski; DocumentNumber: PWSat2-xxx-DW-xxx; Revision: 1-0; SheetNumber: 20; SheetTotal: 51; Model: EM1
Used 2 times, as channels Top/MPPT Y+/MPPTY Input EMI Filter, Top/MPPT Y-/MPPTY Input EMI Filter. Parts and nets are listed once, with the designators drawn on the sheet.
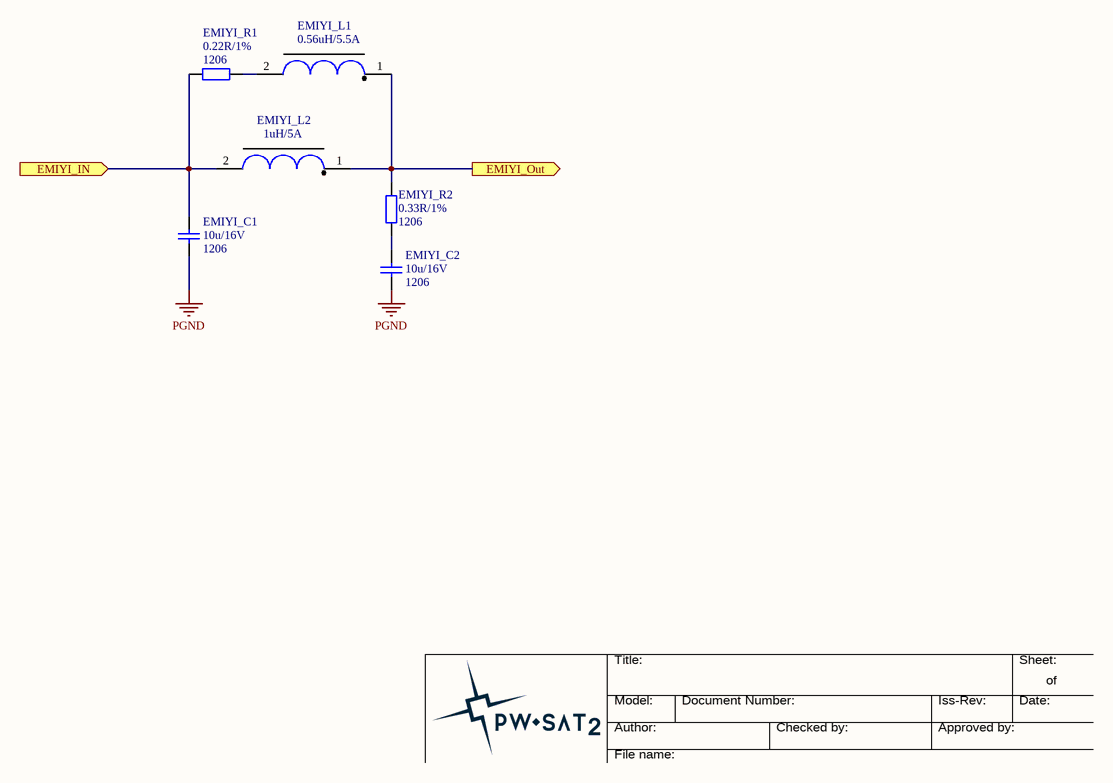
[diagram p15: EPS_MPPT_Y_EMI-Filter_In.SchDoc]

### Parts
EMIYI_C1  Packge: 1206  [SMD_Capacitor_1206]  (hidden comment: 10u/16V)
EMIYI_C2  Packge: 1206  [SMD_Capacitor_1206]  (hidden comment: 10u/16V)
EMIYI_L1  0.56uH/5.5A  [Vishay_IHLP1212]
EMIYI_L2  1uH/5A  [Vishay_IHLP1212]
EMIYI_R1  Package: 1206  [SMD_Resistor_1206]  (hidden comment: 0.22R/1%)
EMIYI_R2  Package: 1206  [SMD_Resistor_1206]  (hidden comment: 0.33R/1%)

### Ports
EMIYI_IN (in), EMIYI_Out (out)

### Nets
PGND: EMIYI_C1.2 EMIYI_C2.2
EMIYI_IN: EMIYI_C1.1 EMIYI_L2.2 EMIYI_R1.1 ; port EMIYI_IN
EMIYI_Out: EMIYI_L1.1 EMIYI_L2.1 EMIYI_R2.2 ; port EMIYI_Out
NetEMIYI_C2_1: EMIYI_C2.1 EMIYI_R2.1
NetEMIYI_L1_2: EMIYI_L1.2 EMIYI_R1.2

### Channels
Top/MPPT Y+/MPPTY Input EMI Filter: designators end in _1; ports EMIYI_IN=NetEMIYI_C1_1_1 EMIYI_Out=NetDCDCY_C3_1_2
Top/MPPT Y-/MPPTY Input EMI Filter: designators end in _2; ports EMIYI_IN=NetEMIYI_C1_2_1 EMIYI_Out=NetDCDCY_C3_2_2

### Notes on the sheet
- Title:
- Sheet:
- of
- Author:
- Model:
- Document Number:
- Checked by:
- Iss-Rev:
- Approved by:
- Date:
- File name:

### Library data of the parts
EMIYI_C1 EMIYI_C2 = Cer_C1206T106K4RACTU: Ceramic Cap Kemet COTS 10u/16V X7R 1206; ManufacturerPartNumber: C1206T106K4RACTU; Manufacturer: Kemet; Value: 10u/16V
EMIYI_L1 = IHLP1212BZERR56M11: as EMIXI_L1 on sheet EPS_MPPT_X_EMI-Filter_In; Manufacturer: Vishay; ManufacturerPartNumber: IHLP1212BZERR56M11; Value: 0.56uH/5.5A
EMIYI_L2 = IHLP1212BZER1R0M11: as EMIXI_L2 on sheet EPS_MPPT_X_EMI-Filter_In; Manufacturer: Vishay; ManufacturerPartNumber: IHLP1212BZER1R0M11; Value: 1uH/5A
EMIYI_R1 = ERJ-8BQFR22V: Panasonic Resistor 0.22R 1% 1206 330mW; Manufacturer: Panasonic; ManufacturerPartNumber: ERJ-8BQFR22V; Value: 0.22R/1%
EMIYI_R2 = ERJ-8BQFR33V: Panasonic Resistor 0.33R 1% 1206 330mW; Manufacturer: Panasonic; ManufacturerPartNumber: ERJ-8BQFR33V; Value: 0.33R/1%

## Sheet EPS_MPPT_Y_EMI-Filter_Out.SchDoc: EMI Filter CH1 B
size A4; Date: 2015-10-11; Author: Piotr Kuligowski; DocumentNumber: PWSat2-xxx-DW-xxx; Revision: 1-0; SheetNumber: 22; SheetTotal: 51; Model: EM1
Used 2 times, as channels Top/MPPT Y+/MPPTY Output EMI Filter, Top/MPPT Y-/MPPTY Output EMI Filter. Parts and nets are listed once, with the designators drawn on the sheet.
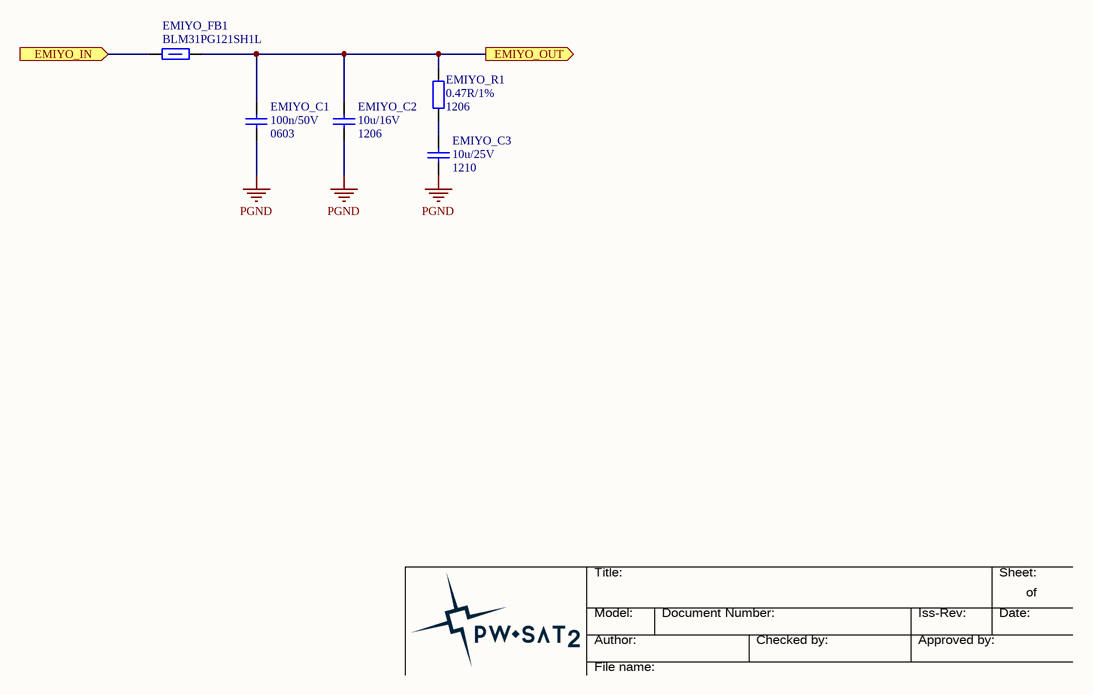
[diagram p16: EPS_MPPT_Y_EMI-Filter_Out.SchDoc]

### Parts
EMIYO_C1  Package: 0603  [SMD_Capacitor_0603]  (hidden comment: 100n/50V)
EMIYO_C2  Packge: 1206  [SMD_Capacitor_1206]  (hidden comment: 10u/16V)
EMIYO_C3  Package: 1210  [SMD_Capacitor_1210]  (hidden comment: 10u/25V)
EMIYO_FB1  120R/100MHz  [SMD_FerriteBead_1206]  (value not drawn)
EMIYO_R1  Package: 1206  [SMD_Resistor_1206]  (hidden comment: 0.47R/1%)

### Ports
EMIYO_IN (in), EMIYO_OUT (out)

### Nets
PGND: EMIYO_C1.2 EMIYO_C2.2 EMIYO_C3.2
EMIYO_IN: EMIYO_FB1.2 ; port EMIYO_IN
EMIYO_OUT: EMIYO_C1.1 EMIYO_C2.1 EMIYO_FB1.1 EMIYO_R1.2 ; port EMIYO_OUT
NetEMIYO_C3_1: EMIYO_C3.1 EMIYO_R1.1

### Channels
Top/MPPT Y+/MPPTY Output EMI Filter: designators end in _1; ports EMIYO_IN=NetDCDCY_C4_1_2 EMIYO_OUT=NetEMIYO_C1_1_1
Top/MPPT Y-/MPPTY Output EMI Filter: designators end in _2; ports EMIYO_IN=NetDCDCY_C4_2_2 EMIYO_OUT=NetEMIYO_C1_2_1

### Notes on the sheet
- Title:
- Sheet:
- of
- Author:
- Model:
- Document Number:
- Checked by:
- Iss-Rev:
- Approved by:
- Date:
- File name:

### Library data of the parts
EMIYO_C1 = Cer_C0603T104K5RALTU: Ceramic Cap Kemet COTS 100n/50V X7R 0603; Manufacturer: Kemet; ManufacturerPartNumber: C0603T104K5RALTU; Value: 100n/50V
EMIYO_C2 = Cer_C1206T106K4RACTU: Ceramic Cap Kemet COTS 10u/16V X7R 1206; ManufacturerPartNumber: C1206T106K4RACTU; Manufacturer: Kemet; Value: 10u/16V
EMIYO_C3 = Cer_GCJ32ER71E106KA12L: as EMIXI_C1 on sheet EPS_MPPT_X_EMI-Filter_In; Manufacturer: Murata; ManufacturerPartNumber: GCJ32ER71E106KA12L; Value: 10u/25V
EMIYO_FB1 = BLM31PG121SH1L: as EMIYS_FB1 on sheet EPS_MPPT_Y_EMI-Filter_Solar-Panels; Package: 1206; Value: 120R/100MHz; ManufacturerPartNumber: BLM31PG121SH1L
EMIYO_R1 = ERJ-8BQFR47V: Panasonic Resistor 0.47R 1% 1206 330mW; ManufacturerPartNumber: ERJ-8BQFR47V; Manufacturer: Panasonic; Value: 0.47R/1%

## Sheet EPS_MPPT_Y_OR_MPB.SchDoc: MPPT-Y / MPB ORing
size A4; ApprovedBy: (not approved); CheckedBy: (not checked); Author: Piotr Kuligowski; DocumentNumber: PWSat2-xxx-DW-xxx; Revision: 3; SheetNumber: 23; SheetTotal: 51; Model: FPM
Used 2 times, as channels Top/MPPT Y+/MPPTY ORing to MPB, Top/MPPT Y-/MPPTY ORing to MPB. Parts and nets are listed once, with the designators drawn on the sheet.
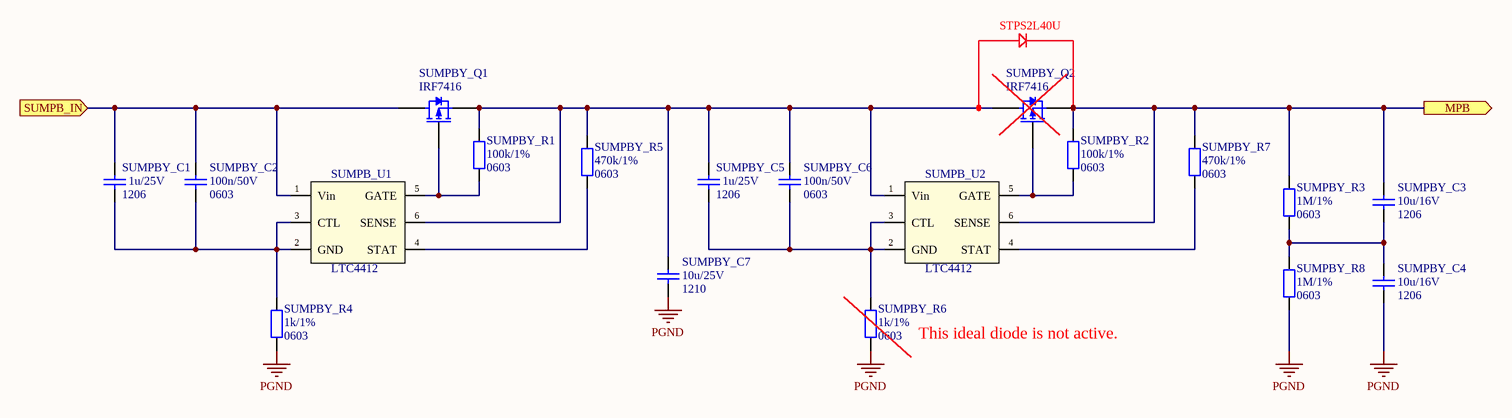
[diagram p17: EPS_MPPT_Y_OR_MPB.SchDoc]

### Parts
SUMPB_U1  LTC4412  [SOT23-6]
SUMPB_U2  LTC4412  [SOT23-6]
SUMPBY_C1  Package: 1206  [SMD_Capacitor_1206]  (hidden comment: 1u/25V)
SUMPBY_C2  Package: 0603  [SMD_Capacitor_0603]  (hidden comment: 100n/50V)
SUMPBY_C3  Packge: 1206  [SMD_Capacitor_1206]  (hidden comment: 10u/16V)
SUMPBY_C4  Packge: 1206  [SMD_Capacitor_1206]  (hidden comment: 10u/16V)
SUMPBY_C5  Package: 1206  [SMD_Capacitor_1206]  (hidden comment: 1u/25V)
SUMPBY_C6  Package: 0603  [SMD_Capacitor_0603]  (hidden comment: 100n/50V)
SUMPBY_C7  Package: 1210  [SMD_Capacitor_1210]  (hidden comment: 10u/25V)
SUMPBY_Q1  IRF7416  [SOIC-8-N_SSSGDDDD]
SUMPBY_Q2  IRF7416  [SOIC-8-N_SSSGDDDD]
SUMPBY_R1  Package: 0603  [SMD_Resistor_0603]  (hidden comment: 100k/1%)
SUMPBY_R2  Package: 0603  [SMD_Resistor_0603]  (hidden comment: 100k/1%)
SUMPBY_R3  Package: 0603  [SMD_Resistor_0603]  (hidden comment: 1M/1%)
SUMPBY_R4  Package: 0603  [SMD_Resistor_0603]  (hidden comment: 1k/1%)
SUMPBY_R5  Package: 0603  [SMD_Resistor_0603]  (hidden comment: 470k/1%)
SUMPBY_R6  Package: 0603  [SMD_Resistor_0603]  (hidden comment: 1k/1%)
SUMPBY_R7  Package: 0603  [SMD_Resistor_0603]  (hidden comment: 470k/1%)
SUMPBY_R8  Package: 0603  [SMD_Resistor_0603]  (hidden comment: 1M/1%)

### Ports
MPB (out), SUMPB_IN (in)

### Nets
PGND: SUMPBY_C4.2 SUMPBY_C7.2 SUMPBY_R4.2 SUMPBY_R6.2 SUMPBY_R8.2
MPB: SUMPB_U2.6(SENSE) SUMPBY_C3.1 SUMPBY_Q2.S SUMPBY_R2.1 SUMPBY_R3.1 SUMPBY_R7.1 ; port MPB
SUMPB_IN: SUMPB_U1.1(Vin) SUMPBY_C1.1 SUMPBY_C2.1 SUMPBY_Q1.D ; port SUMPB_IN
NetSUMPB_U1_2: SUMPB_U1.2(GND) SUMPB_U1.3(CTL) SUMPBY_C1.2 SUMPBY_C2.2 SUMPBY_R4.1
NetSUMPB_U1_4: SUMPB_U1.4(STAT) SUMPBY_R5.2
NetSUMPB_U1_5: SUMPB_U1.5(GATE) SUMPBY_Q1.G SUMPBY_R1.2
NetSUMPB_U1_6: SUMPB_U1.6(SENSE) SUMPB_U2.1(Vin) SUMPBY_C5.1 SUMPBY_C6.1 SUMPBY_C7.1 SUMPBY_Q1.S SUMPBY_Q2.D SUMPBY_R1.1 SUMPBY_R5.1
NetSUMPB_U2_2: SUMPB_U2.2(GND) SUMPB_U2.3(CTL) SUMPBY_C5.2 SUMPBY_C6.2 SUMPBY_R6.1
NetSUMPB_U2_4: SUMPB_U2.4(STAT) SUMPBY_R7.2
NetSUMPB_U2_5: SUMPB_U2.5(GATE) SUMPBY_Q2.G SUMPBY_R2.2
NetSUMPBY_C3_2: SUMPBY_C3.2 SUMPBY_C4.1 SUMPBY_R3.2 SUMPBY_R8.1

### Channels
Top/MPPT Y+/MPPTY ORing to MPB: designators end in _1; ports MPB=PC-104_Kill-Switch_Pri SUMPB_IN=NetEMIYO_C1_1_1
Top/MPPT Y-/MPPTY ORing to MPB: designators end in _2; ports MPB=PC-104_Kill-Switch_Pri SUMPB_IN=NetEMIYO_C1_2_1

### Notes on the sheet
- STPS2L40U
- (near SUMPBY_R6) This ideal diode is not active.
- Title:
- Project:
- Author:
- Model:
- Document Number:
- Checked by:
- Rev:
- Date:
- Approved by:
- Sheet:
- of
- File name:

### Library data of the parts
SUMPB_U1 SUMPB_U2 = LTC4412: as SUMPB_U1 on sheet EPS_MPPT_X_OR_MPB; Value: LTC4412
SUMPBY_C1 SUMPBY_C5 = Cer_C1206T105K3RALTU: Ceramic Cap Kemet COTS 1u/25V X7R 1206; ManufacturerPartNumber: C1206T105K3RALTU; Manufacturer: Kemet; Value: 1u/25V
SUMPBY_C2 SUMPBY_C6 = Cer_GCJ188R71H104KA12D: as SUMPBX_C2 on sheet EPS_MPPT_X_OR_MPB; Manufacturer: Murata; ManufacturerPartNumber: GCJ188R71H104KA12D; Value: 100n/50V
SUMPBY_C3 SUMPBY_C4 = Cer_C1206T106K4RACTU: Ceramic Cap Kemet COTS 10u/16V X7R 1206; ManufacturerPartNumber: C1206T106K4RACTU; Manufacturer: Kemet; Value: 10u/16V
SUMPBY_C7 = Cer_GCJ32ER71E106KA12L: as EMIXI_C1 on sheet EPS_MPPT_X_EMI-Filter_In; Manufacturer: Murata; ManufacturerPartNumber: GCJ32ER71E106KA12L; Value: 10u/25V
SUMPBY_Q1 SUMPBY_Q2 = IRF7416: as SUMPBX_Q1 on sheet EPS_MPPT_X_OR_MPB; Value: IRF7416
SUMPBY_R1-SUMPBY_R8 = Res
  SUMPBY_R1 SUMPBY_R2: Value: 100k/1%
  SUMPBY_R3 SUMPBY_R8: Value: 1M/1%
  SUMPBY_R4 SUMPBY_R6: Value: 1k/1%
  SUMPBY_R5 SUMPBY_R7: Value: 470k/1%

## Sheet EPS_3V3.SchDoc: 3V3
size A4; ApprovedBy: (not approved); CheckedBy: (not checked); Author: Piotr Kuligowski; DocumentNumber: PWSat2-xxx-DW-xxx; Revision: 3; SheetNumber: 39; SheetTotal: 51; Model: FPM
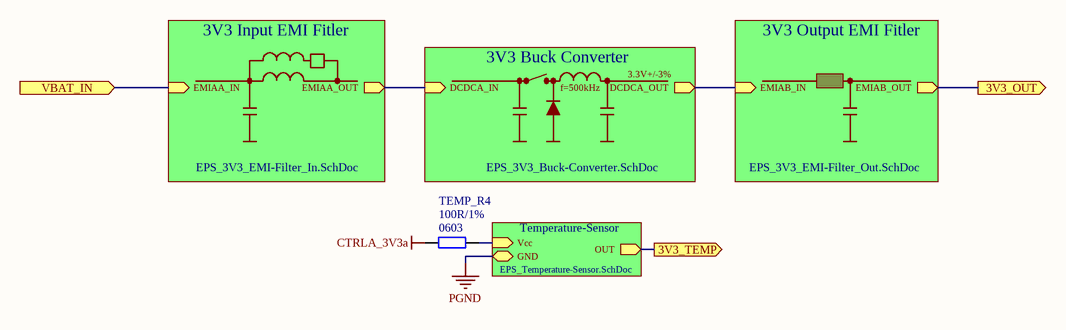
[diagram p18: EPS_3V3.SchDoc]

### Parts
TEMP_R4  Package: 0603  [SMD_Resistor_0603]  (hidden comment: 100R/1%)

### Sub-sheets
3V3 Buck Converter = EPS_3V3_Buck-Converter.SchDoc (file not in this document): DCDCA_IN (in), DCDCA_OUT (out)
3V3 Input EMI Fitler = EPS_3V3_EMI-Filter_In.SchDoc (file not in this document): EMIAA_IN (in), EMIAA_OUT (out)
3V3 Output EMI Fitler = EPS_3V3_EMI-Filter_Out.SchDoc (file not in this document): EMIAB_IN (in), EMIAB_OUT (out)
Temperature-Sensor = EPS_Temperature-Sensor.SchDoc: OUT (out), Vcc (in), GND

### Ports
3V3_OUT (out), 3V3_TEMP (out), VBAT_IN (in)

### Nets
CTRLA_3V3a: TEMP_R4.2
CTRLA_HK_3V3_TEMP: port 3V3_TEMP, sheet Temperature-Sensor/OUT
NetDRLCL_C4_1_1: port VBAT_IN, sheet 3V3 Input EMI Fitler/EMIAA_IN
NetHK_R1_2_4: port 3V3_OUT, sheet 3V3 Output EMI Fitler/EMIAB_OUT
NetTEMP_C1_2_1: TEMP_R4.1 ; sheet Temperature-Sensor/Vcc
(unnamed): sheet 3V3 Buck Converter/DCDCA_IN, sheet 3V3 Input EMI Fitler/EMIAA_OUT
(unnamed): sheet 3V3 Buck Converter/DCDCA_OUT, sheet 3V3 Output EMI Fitler/EMIAB_IN

### Notes on the sheet
- 3.3V+/-3%
- f=500kHz
- Title:
- Project:
- Author:
- Model:
- Document Number:
- Checked by:
- Rev:
- Date:
- Approved by:
- Sheet:
- of
- File name:

### Library data of the parts
TEMP_R4 = CRCW06031K00FKxxxx: 1k/1% Vishay CRCW 0603 Resistor. 100mW, 100ppm, 75V.; Manufacturer: Vishay; ManufacturerPartNumber: CRCW06031K00FKxxxx; Value: 100R/1%

## Sheet EPS_5V.SchDoc: 5V
size A4; ApprovedBy: (not approved); CheckedBy: (not checked); Author: Piotr Kuligowski; DocumentNumber: PWSat2-xxx-DW-xxx; Revision: 3; SheetNumber: 43; SheetTotal: 51; Model: FPM
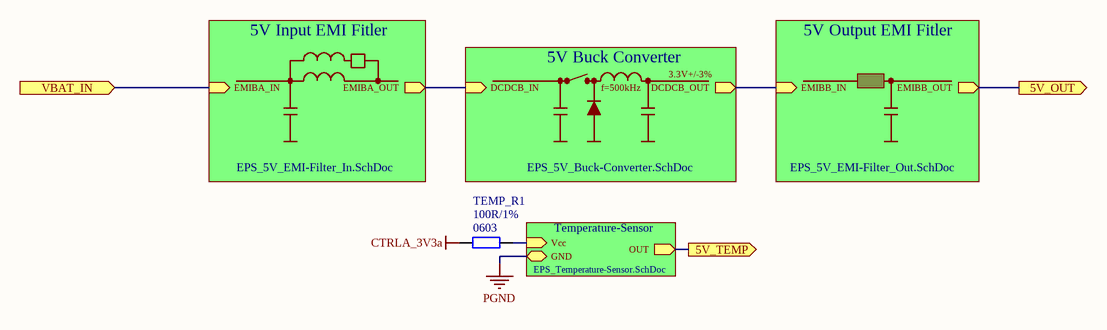
[diagram p19: EPS_5V.SchDoc]

### Parts
TEMP_R1  Package: 0603  [SMD_Resistor_0603]  (hidden comment: 100R/1%)

### Sub-sheets
5V Buck Converter = EPS_5V_Buck-Converter.SchDoc (file not in this document): DCDCB_OUT (out), DCDCB_IN (in)
5V Input EMI Fitler = EPS_5V_EMI-Filter_In.SchDoc (file not in this document): EMIBA_OUT (out), EMIBA_IN (in)
5V Output EMI Fitler = EPS_5V_EMI-Filter_Out.SchDoc: EMIBB_IN (in), EMIBB_OUT (out)
Temperature-Sensor = EPS_Temperature-Sensor.SchDoc: OUT (out), Vcc (in), GND

### Ports
5V_OUT (out), 5V_TEMP (out), VBAT_IN (in)

### Nets
CTRLA_3V3a: TEMP_R1.2
CTRLA_HK_5V_TEMP: port 5V_TEMP, sheet Temperature-Sensor/OUT
NetDRLCL_C4_1_1: port VBAT_IN, sheet 5V Input EMI Fitler/EMIBA_IN
NetEMIBB_C1_1: port 5V_OUT, sheet 5V Output EMI Fitler/EMIBB_OUT
NetEMIBB_FB1_2: sheet 5V Buck Converter/DCDCB_OUT, sheet 5V Output EMI Fitler/EMIBB_IN
NetTEMP_C1_3_1: TEMP_R1.1 ; sheet Temperature-Sensor/Vcc
(unnamed): sheet 5V Buck Converter/DCDCB_IN, sheet 5V Input EMI Fitler/EMIBA_OUT

### Notes on the sheet
- 3.3V+/-3%
- f=500kHz
- Title:
- Project:
- Author:
- Model:
- Document Number:
- Checked by:
- Rev:
- Date:
- Approved by:
- Sheet:
- of
- File name:

### Library data of the parts
TEMP_R1 = CRCW06031K00FKxxxx: as TEMP_R4 on sheet EPS_3V3; Manufacturer: Vishay; ManufacturerPartNumber: CRCW06031K00FKxxxx; Value: 100R/1%

## Sheet EPS_5V_EMI-Filter_Out.SchDoc: 5V / EMI-Filter / Out
size A4; ApprovedBy: (not approved); CheckedBy: (not checked); Author: Piotr Kuligowski; DocumentNumber: PWSat2-xxx-DW-xxx; Revision: 3; SheetNumber: 46; SheetTotal: 51; Model: FPM
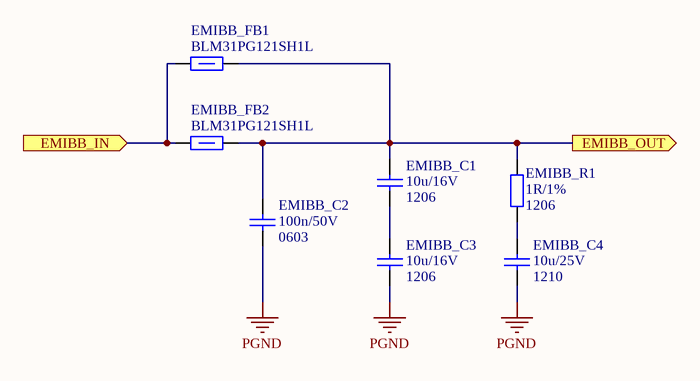
[diagram p20: EPS_5V_EMI-Filter_Out.SchDoc]

### Parts
EMIBB_C1  Packge: 1206  [SMD_Capacitor_1206]  (hidden comment: 10u/16V)
EMIBB_C2  Package: 0603  [SMD_Capacitor_0603]  (hidden comment: 100n/50V)
EMIBB_C3  Packge: 1206  [SMD_Capacitor_1206]  (hidden comment: 10u/16V)
EMIBB_C4  Package: 1210  [SMD_Capacitor_1210]  (hidden comment: 10u/25V)
EMIBB_FB1  120R/100MHz  [SMD_FerriteBead_1206]  (value not drawn)
EMIBB_FB2  120R/100MHz  [SMD_FerriteBead_1206]  (value not drawn)
EMIBB_R1  Package: 1206  [SMD_Resistor_1206]  (hidden comment: 1R/1%)

### Ports
EMIBB_IN (in), EMIBB_OUT (out)

### Nets
PGND: EMIBB_C2.2 EMIBB_C3.2 EMIBB_C4.2
NetEMIBB_C1_1: EMIBB_C1.1 EMIBB_C2.1 EMIBB_FB1.1 EMIBB_FB2.1 EMIBB_R1.1 ; port EMIBB_OUT
NetEMIBB_C1_2: EMIBB_C1.2 EMIBB_C3.1
NetEMIBB_C4_1: EMIBB_C4.1 EMIBB_R1.2
NetEMIBB_FB1_2: EMIBB_FB1.2 EMIBB_FB2.2 ; port EMIBB_IN

### Notes on the sheet
- Title:
- Project:
- Author:
- Model:
- Document Number:
- Checked by:
- Rev:
- Date:
- Approved by:
- Sheet:
- of
- File name:

### Library data of the parts
EMIBB_C1 EMIBB_C3 = Cer_C1206T106K4RACTU: Ceramic Cap Kemet COTS 10u/16V X7R 1206; ManufacturerPartNumber: C1206T106K4RACTU; Manufacturer: Kemet; Value: 10u/16V
EMIBB_C2 = Cer_C0603T104K5RALTU: Ceramic Cap Kemet COTS 100n/50V X7R 0603; Manufacturer: Kemet; ManufacturerPartNumber: C0603T104K5RALTU; Value: 100n/50V
EMIBB_C4 = Cer_GCJ32ER71E106KA12L: as EMIXI_C1 on sheet EPS_MPPT_X_EMI-Filter_In; Manufacturer: Murata; ManufacturerPartNumber: GCJ32ER71E106KA12L; Value: 10u/25V
EMIBB_FB1 EMIBB_FB2 = BLM31PG121SH1L: as EMIYS_FB1 on sheet EPS_MPPT_Y_EMI-Filter_Solar-Panels; Package: 1206; Value: 120R/100MHz; ManufacturerPartNumber: BLM31PG121SH1L
EMIBB_R1 = CRCW12061R00FKxxxx: 1R/1% Vishay CRCW 1206 Resistor. 250mW, 100ppm, 200V.; ManufacturerPartNumber: CRCW12061R00FKxxxx; Manufacturer: Vishay; Value: 1R/1%

## Sheet EPS_RBL.SchDoc: Remove Before Launch
size A4; ApprovedBy: (not approved); CheckedBy: (not checked); Author: Piotr Kuligowski; DocumentNumber: PWSat2-xxx-DW-xxx; Revision: 3; SheetNumber: 32; SheetTotal: 51; Model: FPM
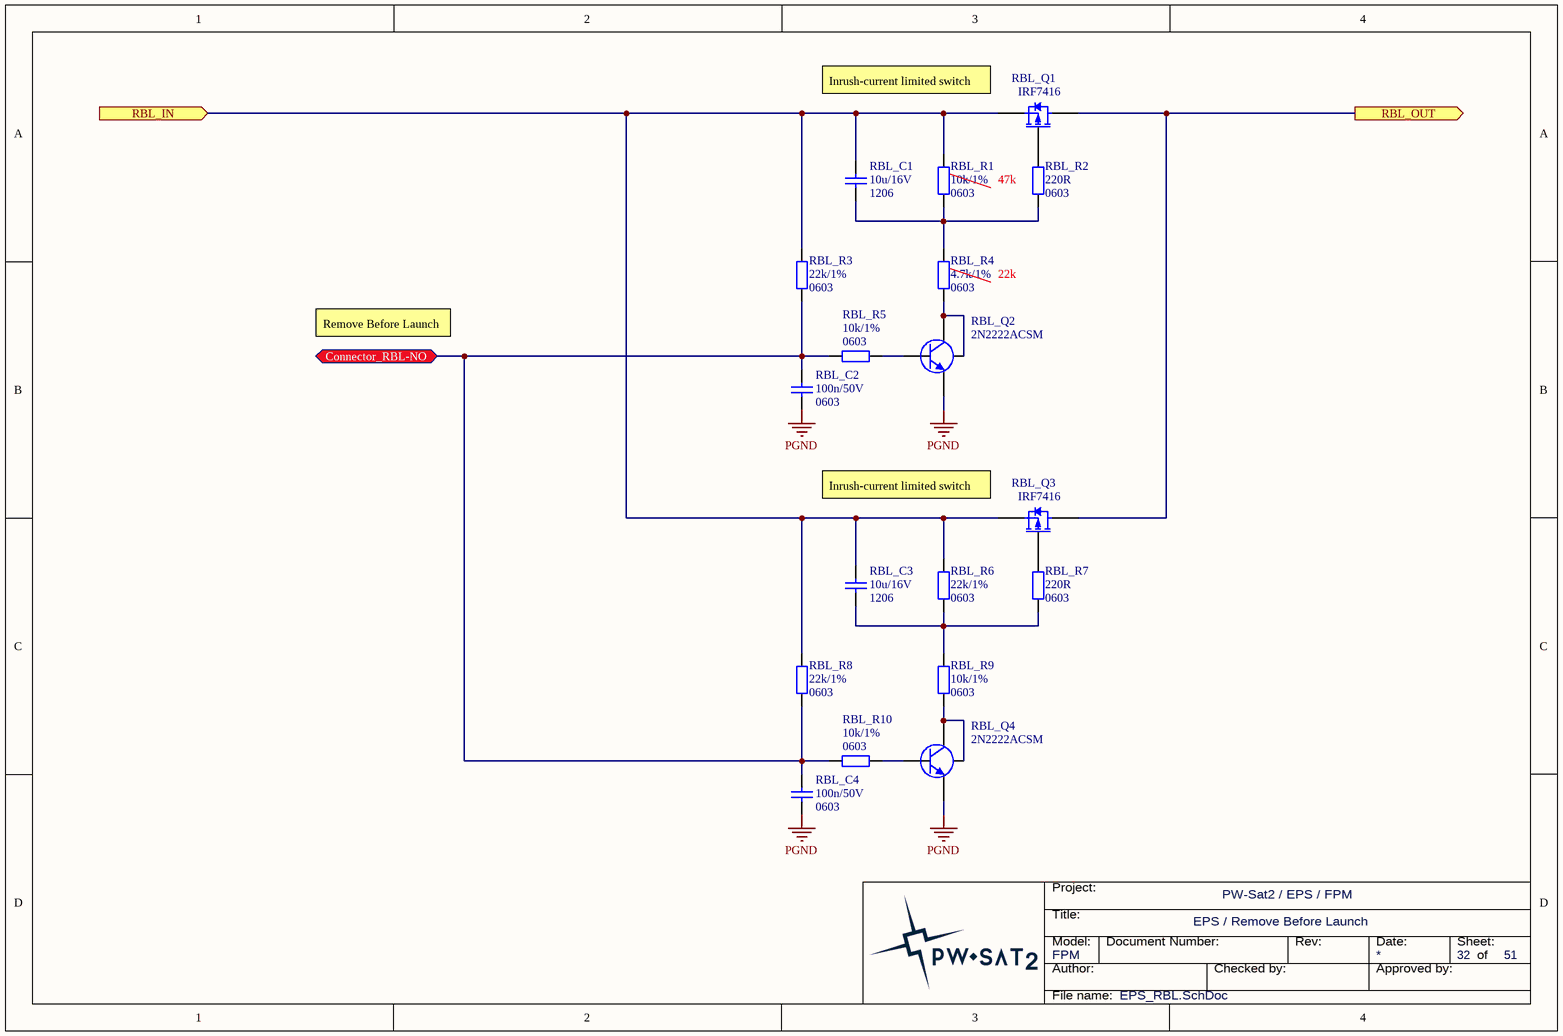
[diagram p21: EPS_RBL.SchDoc]

### Parts
RBL_C1  Packge: 1206  [SMD_Capacitor_1206]  (hidden comment: 10u/16V)
RBL_C2  Package: 0603  [SMD_Capacitor_0603]  (hidden comment: 100n/50V)
RBL_C3  Packge: 1206  [SMD_Capacitor_1206]  (hidden comment: 10u/16V)
RBL_C4  Package: 0603  [SMD_Capacitor_0603]  (hidden comment: 100n/50V)
RBL_Q1  IRF7416  [SOIC-8-N_SSSGDDDD]
RBL_Q2  2N2222ACSM  [LCC1-4_BEC]
RBL_Q3  IRF7416  [SOIC-8-N_SSSGDDDD]
RBL_Q4  2N2222ACSM  [LCC1-4_BEC]
RBL_R1  Package: 0603  [SMD_Resistor_0603]  (hidden comment: 10k/1%)
RBL_R2  Package: 0603  [SMD_Resistor_0603]  (hidden comment: 220R)
RBL_R3  Package: 0603  [SMD_Resistor_0603]  (hidden comment: 22k/1%)
RBL_R4  Package: 0603  [SMD_Resistor_0603]  (hidden comment: 4.7k/1%)
RBL_R5  Package: 0603  [SMD_Resistor_0603]  (hidden comment: 10k/1%)
RBL_R6  Package: 0603  [SMD_Resistor_0603]  (hidden comment: 22k/1%)
RBL_R7  Package: 0603  [SMD_Resistor_0603]  (hidden comment: 220R)
RBL_R8  Package: 0603  [SMD_Resistor_0603]  (hidden comment: 22k/1%)
RBL_R9  Package: 0603  [SMD_Resistor_0603]  (hidden comment: 10k/1%)
RBL_R10  Package: 0603  [SMD_Resistor_0603]  (hidden comment: 10k/1%)

### Ports
Connector_RBL-NO (bidir), RBL_IN (in), RBL_OUT (out)

### Nets
PGND: RBL_C2.2 RBL_C4.2 RBL_Q2.E RBL_Q4.E
PC-104_Kill-Switch_Sec: RBL_C1.1 RBL_C3.1 RBL_Q1.S RBL_Q3.S RBL_R1.1 RBL_R3.1 RBL_R6.1 RBL_R8.1 ; port RBL_IN
NetDRLCL_C1_1_1: RBL_Q1.D RBL_Q3.D ; port RBL_OUT
NetH5_2: RBL_C2.1 RBL_C4.1 RBL_R3.2 RBL_R5.1 RBL_R8.2 RBL_R10.1 ; port Connector_RBL-NO
NetRBL_C1_2: RBL_C1.2 RBL_R1.2 RBL_R2.2 RBL_R4.1
NetRBL_C3_2: RBL_C3.2 RBL_R6.2 RBL_R7.2 RBL_R9.1
NetRBL_Q1_G: RBL_Q1.G RBL_R2.1
NetRBL_Q2_B: RBL_Q2.B RBL_R5.2
NetRBL_Q2_C: RBL_Q2.C RBL_Q2.Shield RBL_R4.2
NetRBL_Q3_G: RBL_Q3.G RBL_R7.1
NetRBL_Q4_B: RBL_Q4.B RBL_R10.2
NetRBL_Q4_C: RBL_Q4.C RBL_Q4.Shield RBL_R9.2

### Notes on the sheet
- (near RBL_Q1) Inrush-current limited switch
- (near RBL_R2) 47k
- 22k
- Remove Before Launch
- (near RBL_Q3) Inrush-current limited switch
- Title:
- Project:
- Author:
- Model:
- Document Number:
- Checked by:
- Rev:
- Date:
- Approved by:
- Sheet:
- of
- File name:

### Library data of the parts
RBL_C1 RBL_C3 = Cer_C1206T106K4RACTU: Ceramic Cap Kemet COTS 10u/16V X7R 1206; ManufacturerPartNumber: C1206T106K4RACTU; Manufacturer: Kemet; Value: 10u/16V
RBL_C2 RBL_C4 = Cer_GCJ188R71H104KA12D: as SUMPBX_C2 on sheet EPS_MPPT_X_OR_MPB; Manufacturer: Murata; ManufacturerPartNumber: GCJ188R71H104KA12D; Value: 100n/50V
RBL_Q1 RBL_Q3 = IRF7416: as SUMPBX_Q1 on sheet EPS_MPPT_X_OR_MPB; Value: IRF7416
RBL_Q2 RBL_Q4 = 2N2222ACSM: Silicon Planar Epitaxial NPN Transistor.; Manufacturer: Semelab-TT; Value: 2N2222ACSM
RBL_R1-RBL_R10 = Res
  RBL_R1 RBL_R5 RBL_R9 RBL_R10: Value: 10k/1%
  RBL_R2 RBL_R7: Value: 220R
  RBL_R3 RBL_R6 RBL_R8: Value: 22k/1%
  RBL_R4: Value: 4.7k/1%

## Sheet EPS_Distribution.SchDoc: Distribution
size A3; ApprovedBy: (not approved); CheckedBy: (not checked); Author: Piotr Kuligowski; DocumentNumber: PWSat2-xxx-DW-xxx; Revision: 3; SheetNumber: 47; SheetTotal: 51; Model: FPM
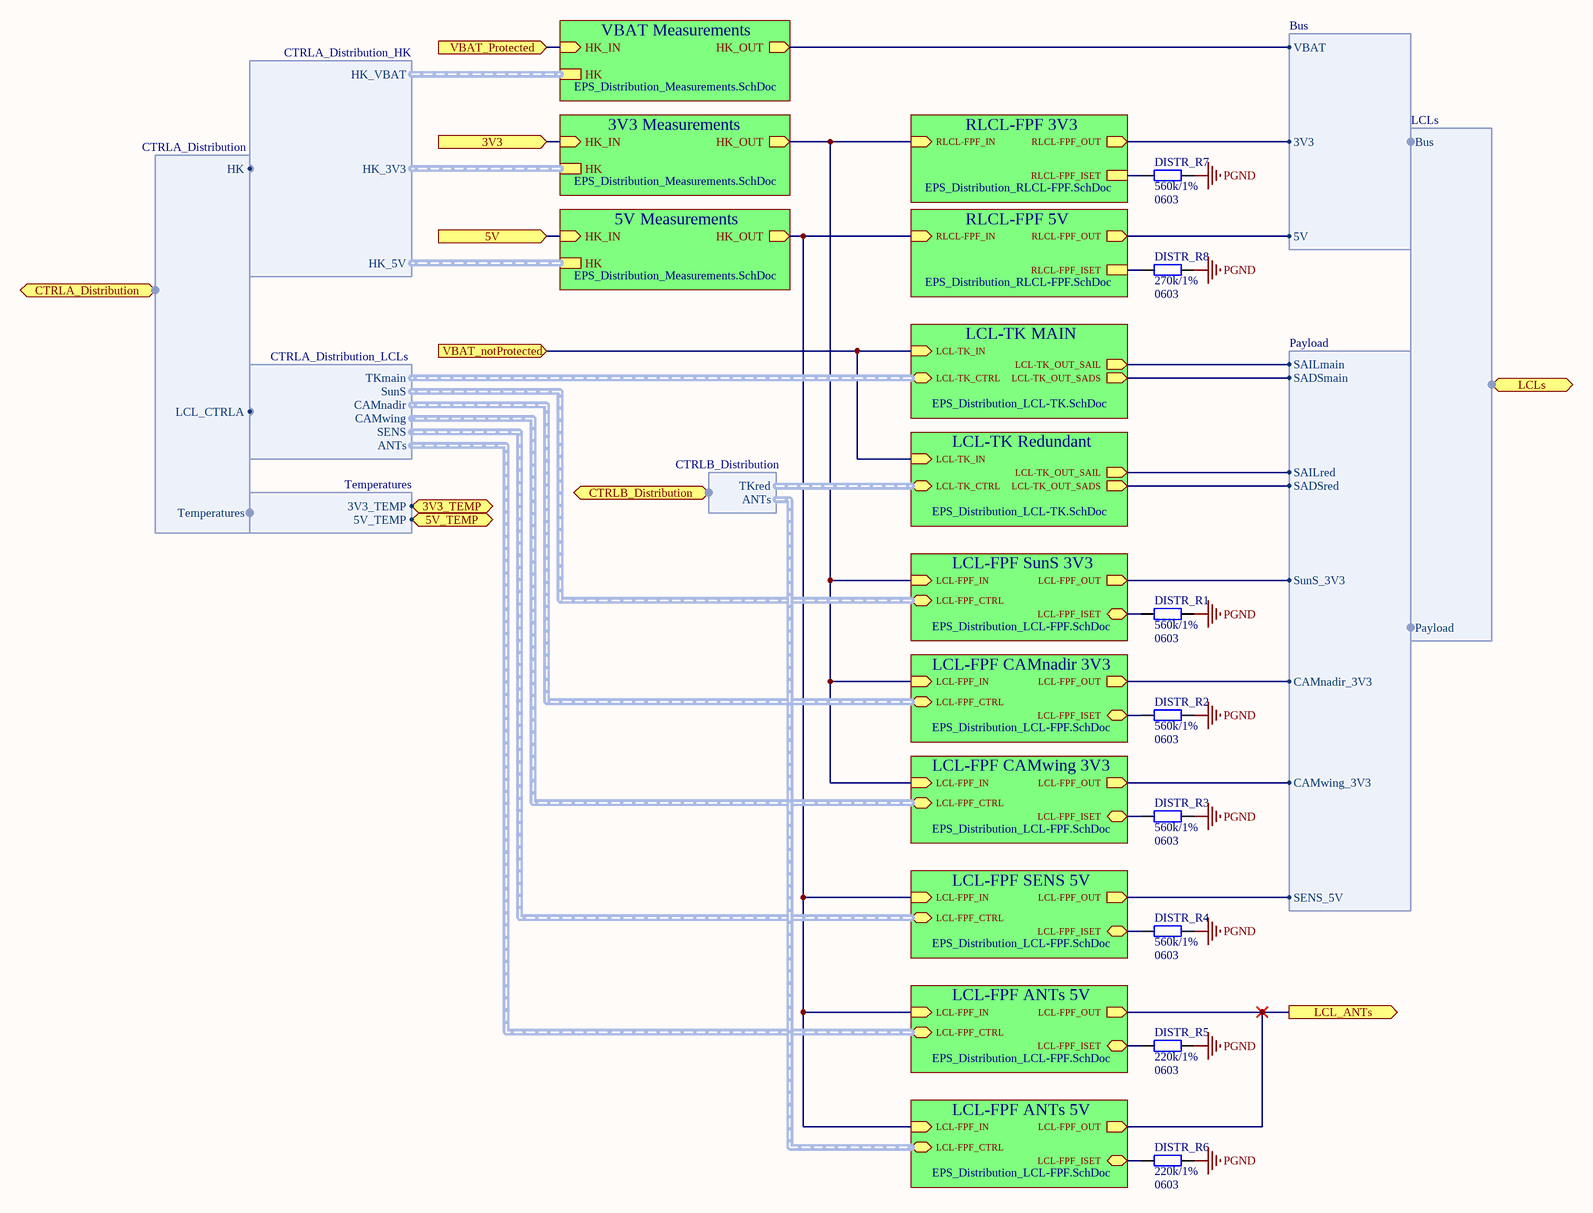
[diagram p22: EPS_Distribution.SchDoc]

### Parts
DISTR_R1  Package: 0603  [SMD_Resistor_0603]  (hidden comment: 560k/1%)
DISTR_R2  Package: 0603  [SMD_Resistor_0603]  (hidden comment: 560k/1%)
DISTR_R3  Package: 0603  [SMD_Resistor_0603]  (hidden comment: 560k/1%)
DISTR_R4  Package: 0603  [SMD_Resistor_0603]  (hidden comment: 560k/1%)
DISTR_R5  Package: 0603  [SMD_Resistor_0603]  (hidden comment: 220k/1%)
DISTR_R6  Package: 0603  [SMD_Resistor_0603]  (hidden comment: 220k/1%)
DISTR_R7  Package: 0603  [SMD_Resistor_0603]  (hidden comment: 560k/1%)
DISTR_R8  Package: 0603  [SMD_Resistor_0603]  (hidden comment: 270k/1%)

### Sub-sheets
3V3 Measurements = EPS_Distribution_Measurements.SchDoc: HK_IN (in), HK_OUT (out), HK (harness HK)
5V Measurements = EPS_Distribution_Measurements.SchDoc: HK_IN (in), HK_OUT (out), HK (harness HK)
LCL-FPF ANTs 5V = EPS_Distribution_LCL-FPF.SchDoc: LCL-FPF_OUT (out), LCL-FPF_ISET, LCL-FPF_IN (in), LCL-FPF_CTRL (harness LCL-FPF_CTRL)
LCL-FPF ANTs 5V = EPS_Distribution_LCL-FPF.SchDoc: LCL-FPF_OUT (out), LCL-FPF_ISET, LCL-FPF_IN (in), LCL-FPF_CTRL (harness LCL-FPF_CTRL)
LCL-FPF CAMnadir 3V3 = EPS_Distribution_LCL-FPF.SchDoc: LCL-FPF_OUT (out), LCL-FPF_ISET, LCL-FPF_IN (in), LCL-FPF_CTRL (harness LCL-FPF_CTRL)
LCL-FPF CAMwing 3V3 = EPS_Distribution_LCL-FPF.SchDoc: LCL-FPF_OUT (out), LCL-FPF_ISET, LCL-FPF_IN (in), LCL-FPF_CTRL (harness LCL-FPF_CTRL)
LCL-FPF SENS 5V = EPS_Distribution_LCL-FPF.SchDoc: LCL-FPF_OUT (out), LCL-FPF_ISET, LCL-FPF_IN (in), LCL-FPF_CTRL (harness LCL-FPF_CTRL)
LCL-FPF SunS 3V3 = EPS_Distribution_LCL-FPF.SchDoc: LCL-FPF_OUT (out), LCL-FPF_ISET, LCL-FPF_IN (in), LCL-FPF_CTRL (harness LCL-FPF_CTRL)
LCL-TK MAIN = EPS_Distribution_LCL-TK.SchDoc: LCL-TK_IN (in), LCL-TK_OUT_SADS (out), LCL-TK_CTRL (harness LCL-TK_CTRL), LCL-TK_OUT_SAIL (out)
LCL-TK Redundant = EPS_Distribution_LCL-TK.SchDoc: LCL-TK_IN (in), LCL-TK_OUT_SADS (out), LCL-TK_CTRL (harness LCL-TK_CTRL), LCL-TK_OUT_SAIL (out)
RLCL-FPF 3V3 = EPS_Distribution_RLCL-FPF.SchDoc: RLCL-FPF_IN (in), RLCL-FPF_OUT (out), RLCL-FPF_ISET
RLCL-FPF 5V = EPS_Distribution_RLCL-FPF.SchDoc: RLCL-FPF_IN (in), RLCL-FPF_OUT (out), RLCL-FPF_ISET
VBAT Measurements = EPS_Distribution_Measurements.SchDoc: HK_IN (in), HK_OUT (out), HK (harness HK)

### Ports
3V3 (in), 3V3_TEMP (in), 5V (in), 5V_TEMP (in), CTRLA_Distribution (harness CTRLA_Distribution), CTRLB_Distribution (harness CTRLB_Distribution), LCL_ANTs (out), LCLs (harness LCLs), VBAT_notProtected (in), VBAT_Protected (in)

### Harnesses
LCLs: Payload, Bus
Payload: SADSred, SAILred, SENS_5V, SAILmain, SADSmain, SunS_3V3, CAMnadir_3V3, CAMwing_3V3
CTRLB_Distribution: TKred, ANTs
Bus: 3V3, 5V, VBAT
CTRLA_Distribution_HK: HK_VBAT, HK_3V3, HK_5V
CTRLA_Distribution_LCLs: TKmain, SunS, CAMnadir, CAMwing, SENS, ANTs
CTRLA_Distribution: LCL_CTRLA, HK, Temperatures
Temperatures: 3V3_TEMP, 5V_TEMP

### Nets
PGND: DISTR_R1.1 DISTR_R2.1 DISTR_R3.1 DISTR_R4.1 DISTR_R5.1 DISTR_R6.1 DISTR_R7.1 DISTR_R8.1
CTRLA_HK_3V3_TEMP: port 3V3_TEMP, harness Temperatures.3V3_TEMP
CTRLA_HK_5V_TEMP: port 5V_TEMP, harness Temperatures.5V_TEMP
PC-104_LCL_3V3: sheet RLCL-FPF 3V3/RLCL-FPF_OUT, harness Bus.3V3
PC-104_LCL_5V: sheet RLCL-FPF 5V/RLCL-FPF_OUT, harness Bus.5V
PC-104_LCL_CAMnadir_3V3: sheet LCL-FPF CAMnadir 3V3/LCL-FPF_OUT, harness Payload.CAMnadir_3V3
PC-104_LCL_CAMwing_3V3: sheet LCL-FPF CAMwing 3V3/LCL-FPF_OUT, harness Payload.CAMwing_3V3
PC-104_LCL_SADSmain: sheet LCL-TK MAIN/LCL-TK_OUT_SADS, harness Payload.SADSmain
PC-104_LCL_SADSred: sheet LCL-TK Redundant/LCL-TK_OUT_SADS, harness Payload.SADSred
PC-104_LCL_SAILmain: sheet LCL-TK MAIN/LCL-TK_OUT_SAIL, harness Payload.SAILmain
PC-104_LCL_SAILred: sheet LCL-TK Redundant/LCL-TK_OUT_SAIL, harness Payload.SAILred
PC-104_LCL_SENS_5V: sheet LCL-FPF SENS 5V/LCL-FPF_OUT, harness Payload.SENS_5V
PC-104_LCL_SunS_3V3: sheet LCL-FPF SunS 3V3/LCL-FPF_OUT, harness Payload.SunS_3V3
PC-104_LCL_VBAT: sheet VBAT Measurements/HK_OUT, harness Bus.VBAT
NetDISTR_R1_2: DISTR_R1.2 ; sheet LCL-FPF SunS 3V3/LCL-FPF_ISET
NetDISTR_R2_2: DISTR_R2.2 ; sheet LCL-FPF CAMnadir 3V3/LCL-FPF_ISET
NetDISTR_R3_2: DISTR_R3.2 ; sheet LCL-FPF CAMwing 3V3/LCL-FPF_ISET
NetDISTR_R4_2: DISTR_R4.2 ; sheet LCL-FPF SENS 5V/LCL-FPF_ISET
NetDISTR_R5_2: DISTR_R5.2 ; sheet LCL-FPF ANTs 5V/LCL-FPF_ISET
NetDISTR_R6_2: DISTR_R6.2 ; sheet LCL-FPF ANTs 5V/LCL-FPF_ISET
NetDISTR_R7_2: DISTR_R7.2 ; sheet RLCL-FPF 3V3/RLCL-FPF_ISET
NetDISTR_R8_2: DISTR_R8.2 ; sheet RLCL-FPF 5V/RLCL-FPF_ISET
NetDRLCL_C1_1_1: port VBAT_notProtected, sheet LCL-TK MAIN/LCL-TK_IN, sheet LCL-TK Redundant/LCL-TK_IN
NetEMIBB_C1_1: port 5V, sheet 5V Measurements/HK_IN
NetH8_1: port LCL_ANTs, sheet LCL-FPF ANTs 5V/LCL-FPF_OUT, sheet LCL-FPF ANTs 5V/LCL-FPF_OUT
NetHK_R1_1_1: sheet LCL-FPF SENS 5V/LCL-FPF_IN, sheet RLCL-FPF 5V/RLCL-FPF_IN, sheet 5V Measurements/HK_OUT, sheet LCL-FPF ANTs 5V/LCL-FPF_IN, sheet LCL-FPF ANTs 5V/LCL-FPF_IN
NetHK_R1_2_1: sheet LCL-FPF SunS 3V3/LCL-FPF_IN, sheet LCL-FPF CAMnadir 3V3/LCL-FPF_IN, sheet LCL-FPF CAMwing 3V3/LCL-FPF_IN, sheet 3V3 Measurements/HK_OUT, sheet RLCL-FPF 3V3/RLCL-FPF_IN
NetHK_R1_2_4: port 3V3, sheet 3V3 Measurements/HK_IN
NetHK_R1_3_4: port VBAT_Protected, sheet VBAT Measurements/HK_IN

### Notes on the sheet
- Title:
- Project:
- Author:
- Model:
- Document Number:
- Checked by:
- Rev:
- Date:
- Approved by:
- Sheet:
- of
- File name:

### Library data of the parts
DISTR_R1-DISTR_R8 = Res
  DISTR_R1-DISTR_R4 DISTR_R7: Value: 560k/1%
  DISTR_R5 DISTR_R6: Value: 220k/1%
  DISTR_R8: Value: 270k/1%